# EAGLE board data-boardv5 (EAGLE 5.12)
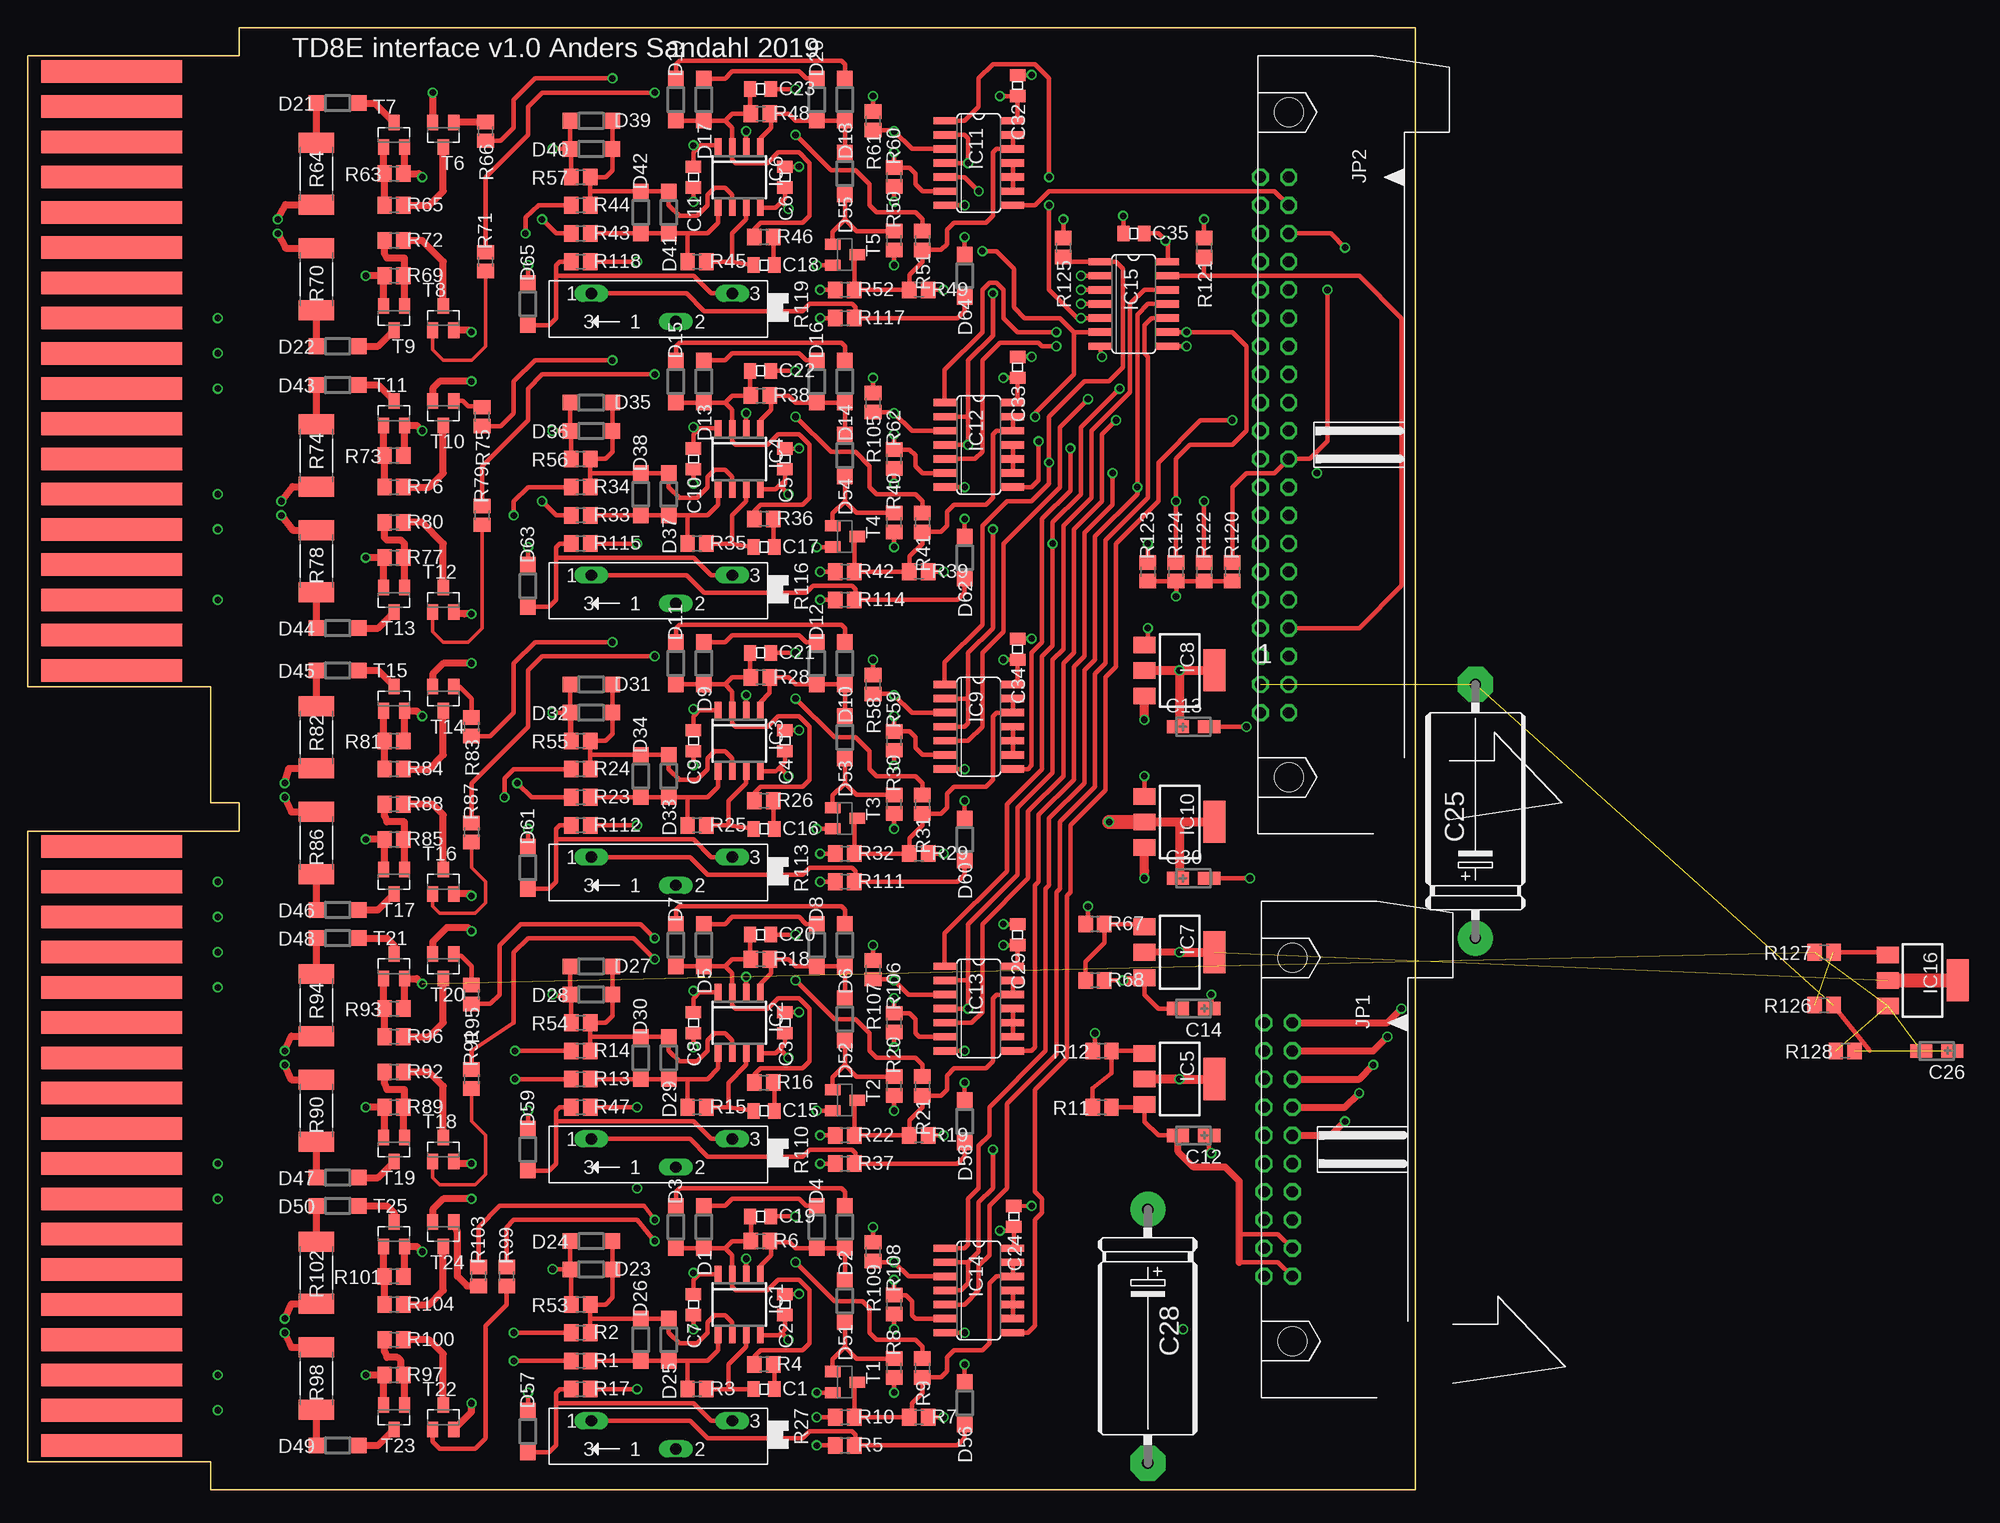
[diagram p13: board, top side]
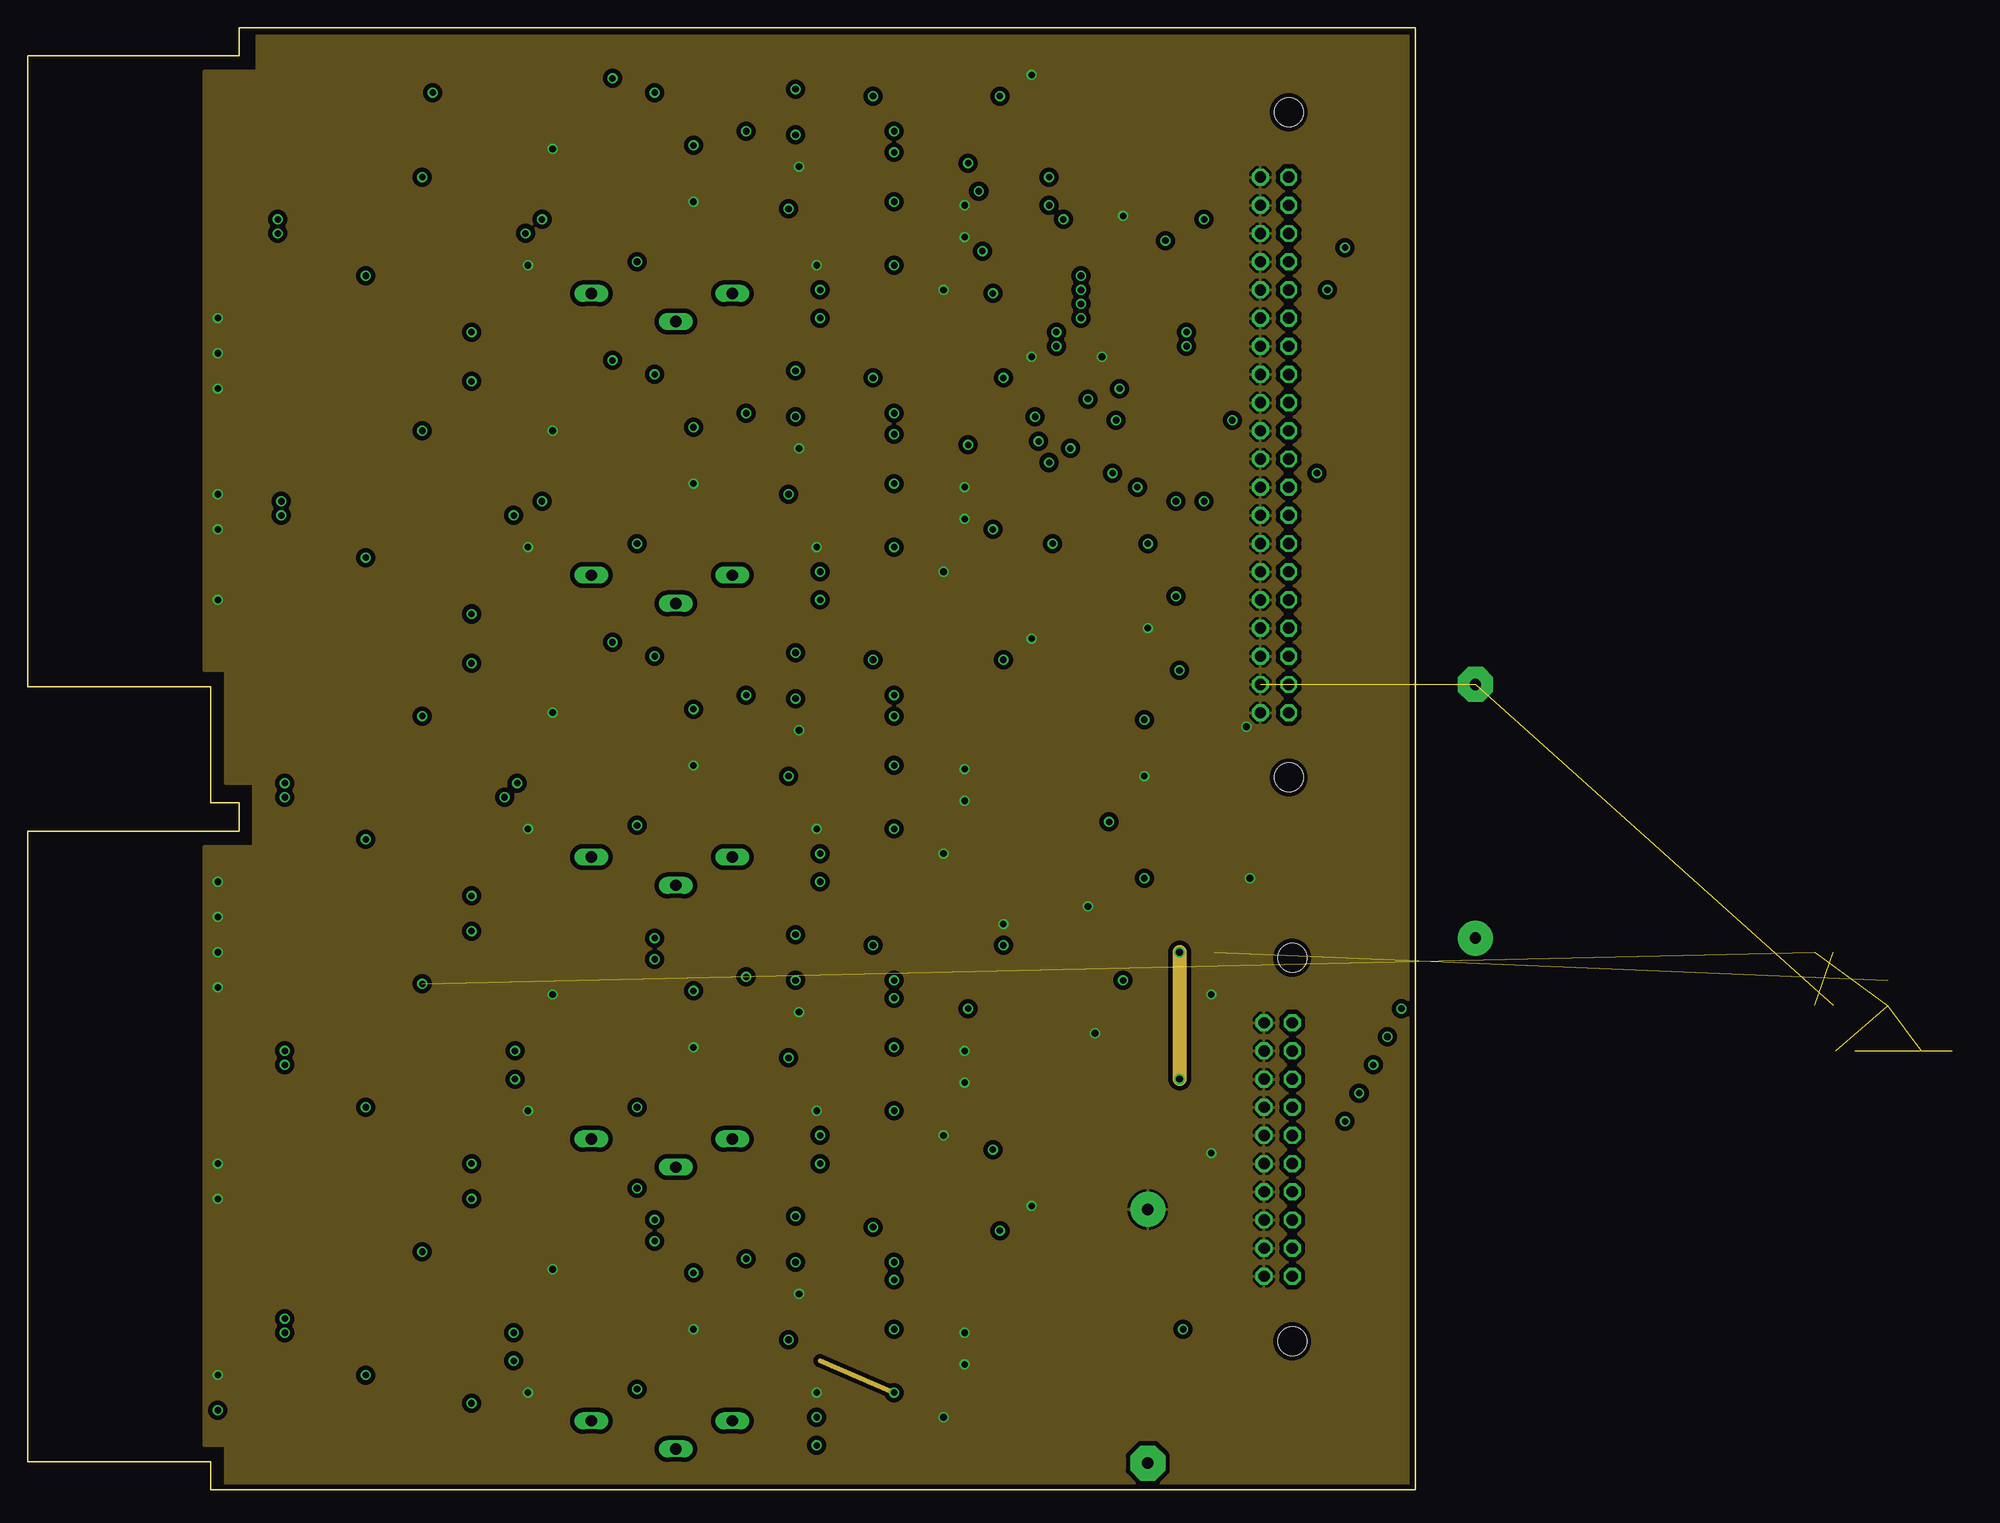
[diagram p14: board, inner layer Route2]
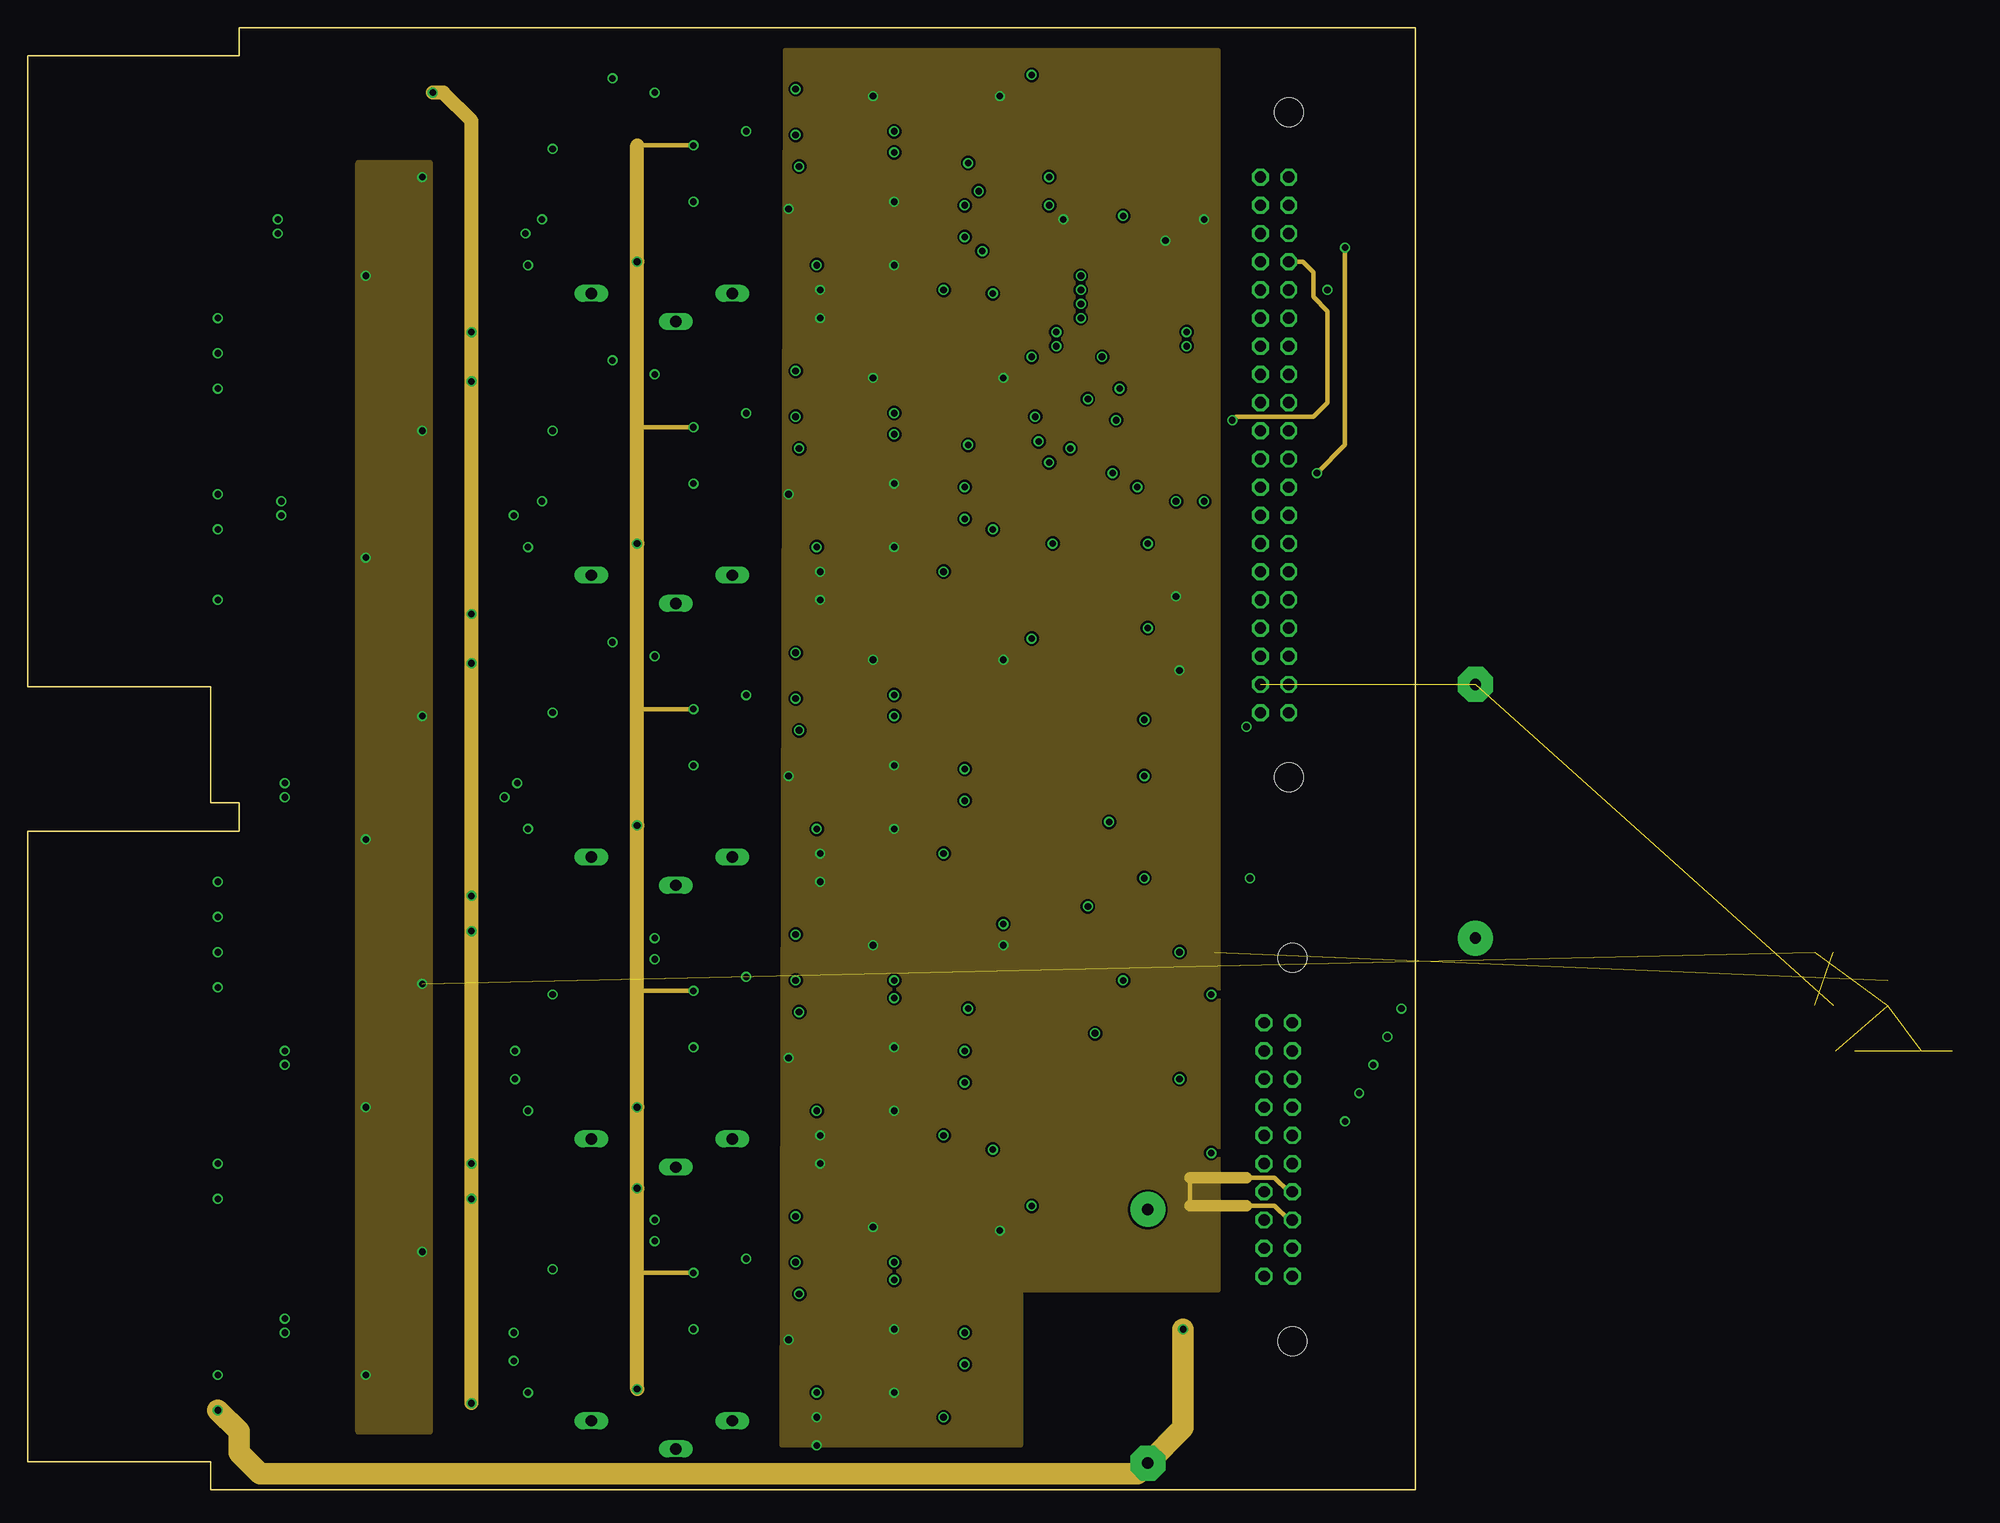
[diagram p15: board, inner layer Route15]
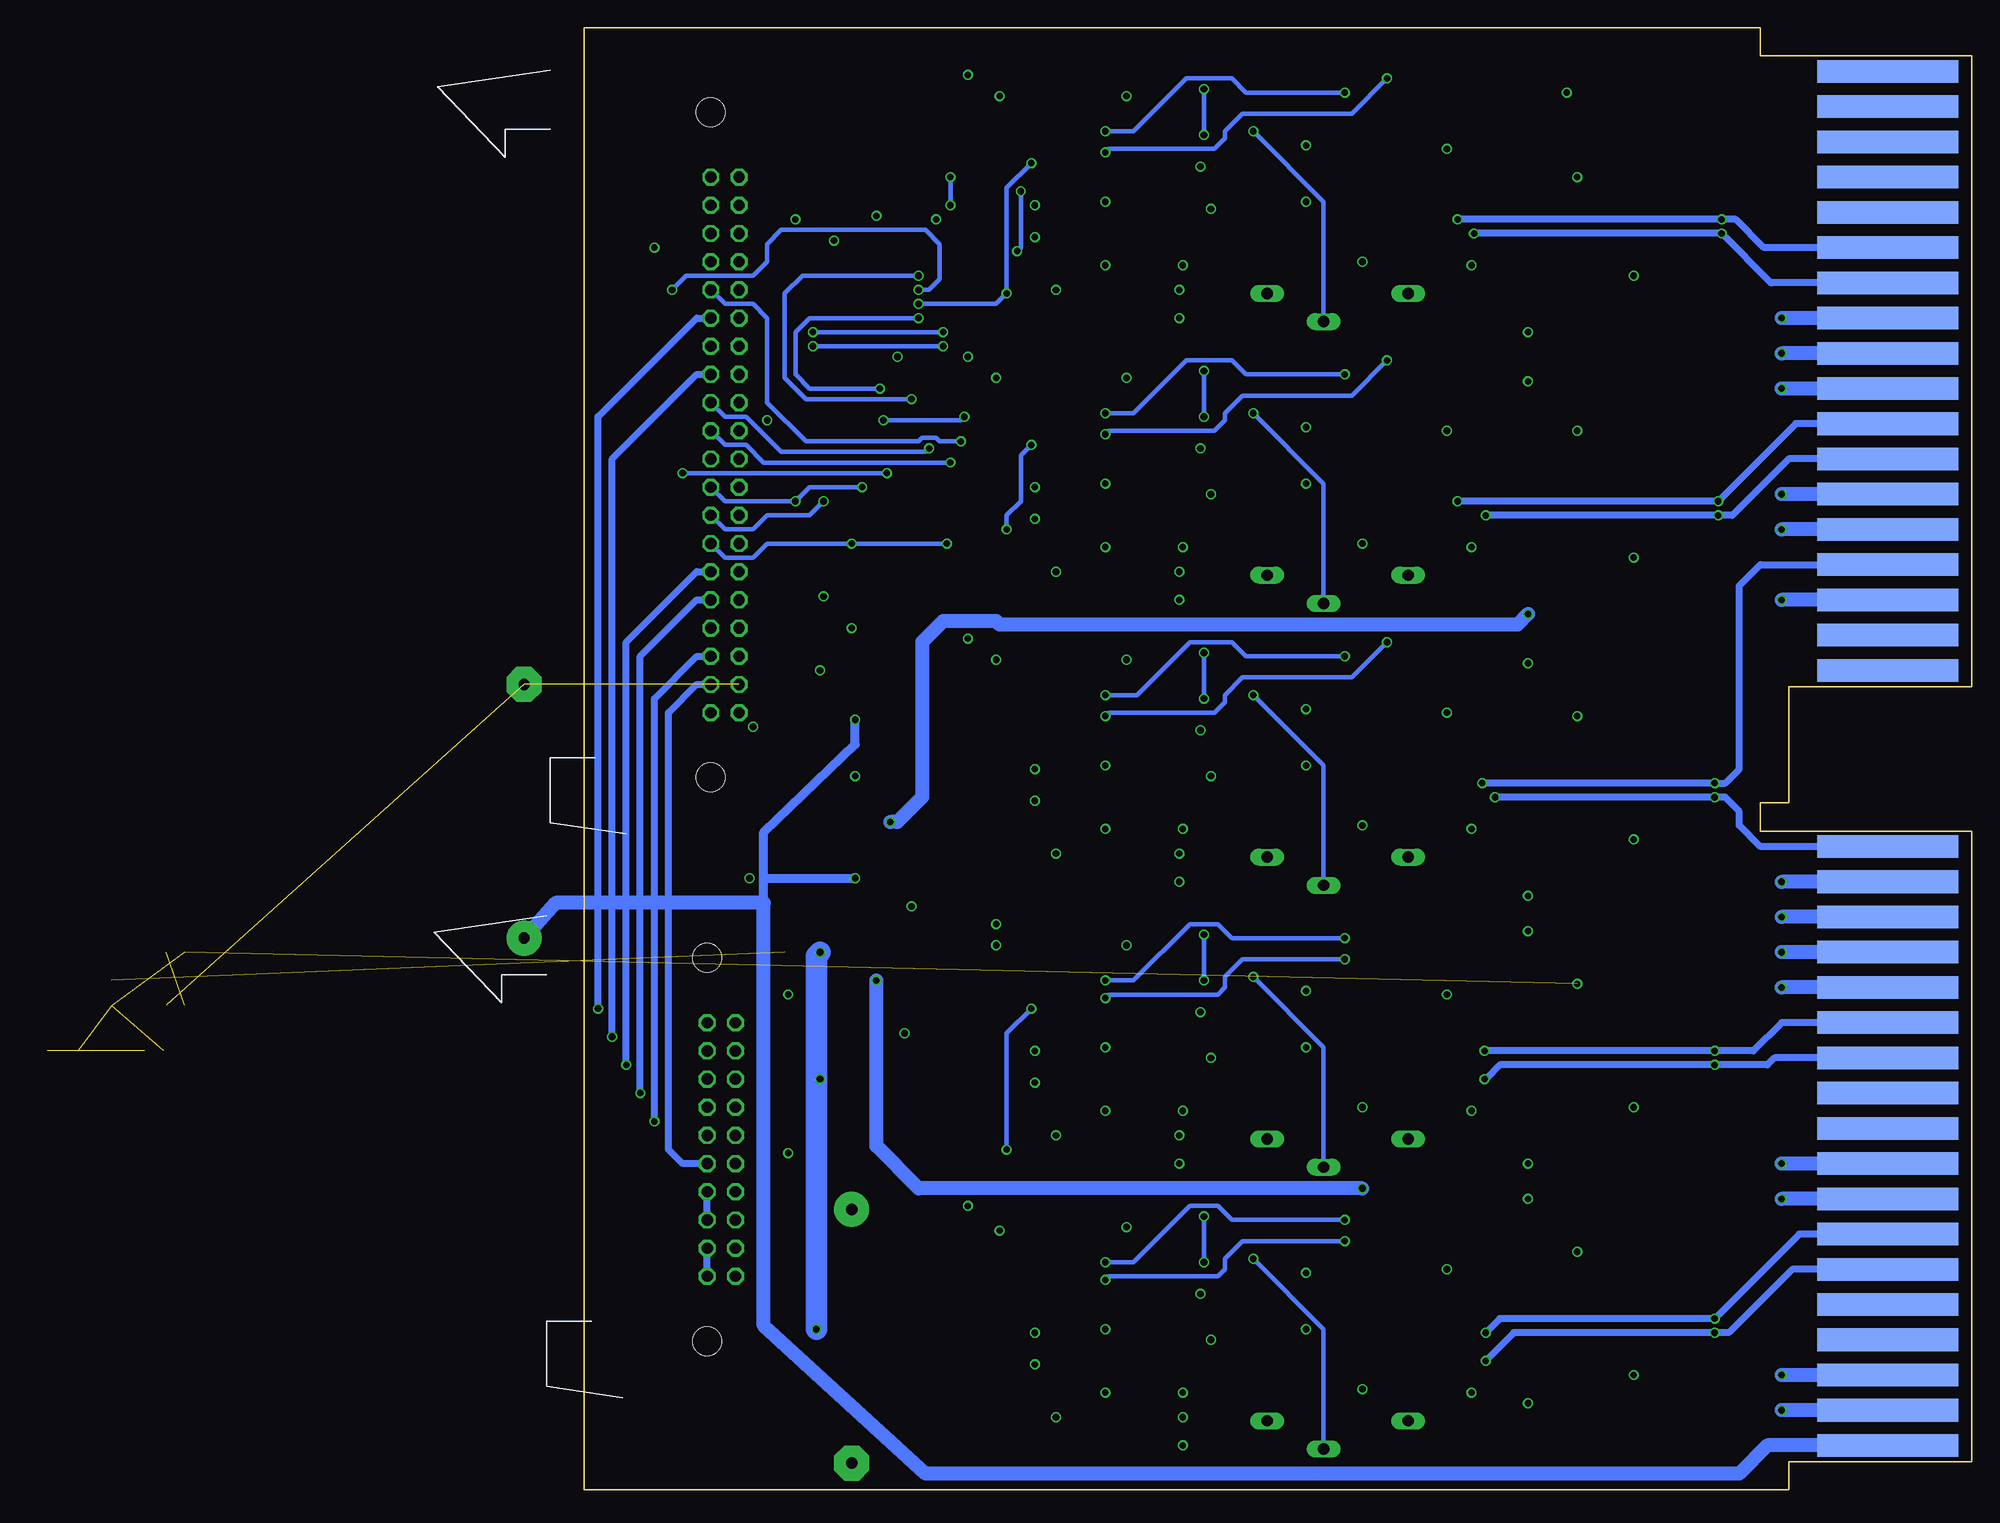
[diagram p16: board, bottom side, seen from below]

Size 125.09 x 131.76 mm. Coordinates in mm from the lower left corner, seen from the top.
Copper layers (1*2*15*16): Top 0.035mm / dielectric 0.2mm / Route2 0.0175mm / dielectric 0.3mm / Route15 0.0175mm / dielectric 0.2mm / Bottom 0.035mm
Design rules "SeeedStudio_4layer_DRU_no_angle_20140221": minimum track width 8mil, minimum drill 12mil, track to track 8mil, track to pad 8mil, pad to pad 8mil, via to via 8mil, smd to smd 0mil, copper to edge 10mil, drill to drill 8mil, minimum pad ring 6mil, minimum via ring 4mil, stop-mask expansion 4mil, vias tented up to drill 100mil, thermal gap 10mil

## Footprints (pad centres in the part's own frame; a part is rotated, then mirrored left to right if it is on the bottom)
0805 = smd 1.092 x 1.397: 1 -0.94,0; 2 0.94,0
CT3216 = smd 2 x 1.2: + -1.4,0; - 1.4,0
E22-9 = drill 1.016 pad 3.15 round: + -11.43,0 | drill 1.016 pad 3.15 octagon: - 11.43,0
SOD123 = smd 1.4 x 1.4: A 1.9,0; C -1.9,0
SOIC8 = smd 0.6 x 1.5: 1 -1.905,-2.75; 2 -0.635,-2.75; 3 0.635,-2.75; 4 1.905,-2.75; 5 1.905,2.75; 6 0.635,2.75; 7 -0.635,2.75; 8 -1.905,2.75
SOT223@1 = smd 1.5 x 2: 1 -2.3,-3.15; 2 0,-3.15; 3 2.3,-3.15 | smd 3.8 x 2: 4 0,3.15
SOT223@2 = smd 1.5 x 2: 1 -2.3,-3.15; 2 0,-3.15; 3 2.3,-3.15 | smd 3.8 x 2: 4 0,3.15
SOT223@3 = smd 1.5 x 2: 1 -2.3,-3.15; 2 0,-3.15; 3 2.3,-3.15 | smd 3.8 x 2: 4 0,3.15
SO14 = smd 0.66 x 2.032: 1 -3.81,-3.073; 2 -2.54,-3.073; 3 -1.27,-3.073; 4 0,-3.073; 5 1.27,-3.073; 6 2.54,-3.073; 7 3.81,-3.073; 8 3.81,3.073; 9 2.54,3.073; 10 1.27,3.073; 11 0,3.073; 12 -1.27,3.073; 13 -2.54,3.073; 14 -3.81,3.073
SOT223 = smd 1.5 x 2: 1 -2.3,-3.15; 2 0,-3.15; 3 2.3,-3.15 | smd 3.8 x 2: 4 0,3.15
FLIPCHIP-21 = smd 12.7 x 2.032: AA1 6.921,0; AB1 6.921,3.175; AC1 6.921,6.35; AD1 6.921,9.525; AE1 6.921,12.7; AF1 6.921,15.875; AH1 6.921,19.05; AJ1 6.921,22.225; AK1 6.921,25.4; AL1 6.921,28.575; AM1 6.921,31.75; AN1 6.921,34.925; AP1 6.921,38.1; AR1 6.921,41.275; AS1 6.921,44.45; AT1 6.921,47.625; AU1 6.921,50.8; AV1 6.921,53.975; BA1 6.921,69.85; BB1 6.921,73.025; BC1 6.921,76.2; BD1 6.921,79.375; BE1 6.921,82.55; BF1 6.921,85.725; BH1 6.921,88.9; BJ1 6.921,92.075; BK1 6.921,95.25; BL1 6.921,98.425; BM1 6.921,101.6; BN1 6.921,104.775; BP1 6.921,107.95; BR1 6.921,111.125; BS1 6.921,114.3; BT1 6.921,117.475; BU1 6.921,120.65; BV1 6.921,123.825 | smd 12.7 x 2.032 bottom: AA2 6.921,0; AB2 6.921,3.175; AC2 6.921,6.35; AD2 6.921,9.525; AE2 6.921,12.7; AF2 6.921,15.875; AH2 6.921,19.05; AJ2 6.921,22.225; AK2 6.921,25.4; AL2 6.921,28.575; AM2 6.921,31.75; AN2 6.921,34.925; AP2 6.921,38.1; AR2 6.921,41.275; AS2 6.921,44.45; AT2 6.921,47.625; AU2 6.921,50.8; AV2 6.921,53.975; BA2 6.921,69.85; BB2 6.921,73.025; BC2 6.921,76.2; BD2 6.921,79.375; BE2 6.921,82.55; BF2 6.921,85.725; BH2 6.921,88.9; BJ2 6.921,92.075; BK2 6.921,95.25; BL2 6.921,98.425; BM2 6.921,101.6; BN2 6.921,104.775; BP2 6.921,107.95; BR2 6.921,111.125; BS2 6.921,114.3; BT2 6.921,117.475; BU2 6.921,120.65; BV2 6.921,123.825
2Z10/90-FRAMED = drill 1.016 octagon: 1 -11.43,-6.35; 2 -11.43,-3.81; 3 -8.89,-6.35; 4 -8.89,-3.81; 5 -6.35,-6.35; 6 -6.35,-3.81; 7 -3.81,-6.35; 8 -3.81,-3.81; 9 -1.27,-6.35; 10 -1.27,-3.81; 11 1.27,-6.35; 12 1.27,-3.81; 13 3.81,-6.35; 14 3.81,-3.81; 15 6.35,-6.35; 16 6.35,-3.81; 17 8.89,-6.35; 18 8.89,-3.81; 19 11.43,-6.35; 20 11.43,-3.81 | hole 2.6: 17.272,-3.81; -17.272,-3.81
2X20/90-FRAMED = drill 1.016 octagon: 1 -24.13,-6.35; 2 -24.13,-3.81; 3 -21.59,-6.35; 4 -21.59,-3.81; 5 -19.05,-6.35; 6 -19.05,-3.81; 7 -16.51,-6.35; 8 -16.51,-3.81; 9 -13.97,-6.35; 10 -13.97,-3.81; 11 -11.43,-6.35; 12 -11.43,-3.81; 13 -8.89,-6.35; 14 -8.89,-3.81; 15 -6.35,-6.35; 16 -6.35,-3.81; 17 -3.81,-6.35; 18 -3.81,-3.81; 19 -1.27,-6.35; 20 -1.27,-3.81; 21 1.27,-6.35; 22 1.27,-3.81; 23 3.81,-6.35; 24 3.81,-3.81; 25 6.35,-6.35; 26 6.35,-3.81; 27 8.89,-6.35; 28 8.89,-3.81; 29 11.43,-6.35; 30 11.43,-3.81; 31 13.97,-6.35; 32 13.97,-3.81; 33 16.51,-6.35; 34 16.51,-3.81; 35 19.05,-6.35; 36 19.05,-3.81; 37 21.59,-6.35; 38 21.59,-3.81; 39 24.13,-6.35; 40 24.13,-3.81 | hole 2.6: 29.972,-3.81; -29.972,-3.81
R0805 = smd 1.3 x 1.5: 1 -0.85,0; 2 0.85,0
SP19L = drill 1.016 long: A 5.715,-1.27; E -6.985,-1.27; S -1.905,1.27
R2512 = smd 1.8 x 3.2: 1 -2.8,0; 2 2.8,0
SOT23 = smd 1 x 1.4: 1 -0.95,-1.1; 2 0.95,-1.1; 3 0,1.1

## Placement (x,y rotation side)
C1  10n  [0805]  66.36,9.08 0 top
C2  100n  [0805]  68.26,16.7 270 top
C3  100n  [0805]  68.26,42.1 270 top
C4  100n  [0805]  68.26,67.5 270 top
C5  100n  [0805]  68.26,92.9 270 top
C6  100n  [0805]  68.26,118.3 270 top
C7  100n  [0805]  60.01,16.7 270 top
C8  100n  [0805]  60.01,42.1 270 top
C9  100n  [0805]  60.01,67.5 270 top
C10  100n  [0805]  60.01,92.9 270 top
C11  100n  [0805]  60.01,118.3 270 top
C12  10u/10V  [CT3216]  105.09,31.94 180 top
C13  10u/10V  [CT3216]  105.09,68.77 0 top
C14  10u/10V  [CT3216]  105.09,43.37 180 top
C15  10n  [0805]  66.36,34.16 0 top
C16  10n  [0805]  66.36,59.56 0 top
C17  10n  [0805]  66.36,84.96 0 top
C18  10n  [0805]  66.36,110.36 0 top
C19  10p  [0805]  66.04,24.64 0 top
C20  10p  [0805]  66.04,50.04 0 top
C21  10p  [0805]  66.04,75.44 0 top
C22  10p  [0805]  66.04,100.84 0 top
C23  10p  [0805]  66.04,126.24 0 top
C24  100n  [0805]  88.9,24.64 270 top
C25  330u  [E22-9]  130.49,61.15 90 top  (outside the outline)
C26  10u/10V  [CT3216]  172.09,39.56 180 top  (outside the outline)
C28  330u  [E22-9]  100.96,13.84 270 top
C29  100n  [0805]  89.22,50.04 270 top
C30  10u/10V  [CT3216]  105.09,55.12 0 top
C32  100n  [0805]  89.22,126.56 270 top
C33  100n  [0805]  89.22,101.16 270 top
C34  100n  [0805]  89.22,75.76 270 top
C35  100n  [0805]  99.69,113.22 0 top
D1  1N4148  [SOD123]  60.96,23.69 270 top
D2  1N4148  [SOD123]  73.66,23.69 270 top
D3  1N4148  [SOD123]  58.42,23.69 90 top
D4  1N4148  [SOD123]  71.12,23.69 90 top
D5  1N4148  [SOD123]  60.96,49.09 270 top
D6  1N4148  [SOD123]  73.66,49.09 270 top
D7  1N4148  [SOD123]  58.42,49.09 90 top
D8  1N4148  [SOD123]  71.12,49.09 90 top
D9  1N4148  [SOD123]  60.96,74.49 270 top
D10  1N4148  [SOD123]  73.66,74.49 270 top
D11  1N4148  [SOD123]  58.42,74.49 90 top
D12  1N4148  [SOD123]  71.12,74.49 90 top
D13  1N4148  [SOD123]  60.96,99.89 270 top
D14  1N4148  [SOD123]  73.66,99.89 270 top
D15  1N4148  [SOD123]  58.42,99.89 90 top
D16  1N4148  [SOD123]  71.12,99.89 90 top
D17  1N4148  [SOD123]  60.96,125.29 270 top
D18  1N4148  [SOD123]  73.66,125.29 270 top
D19  1N4148  [SOD123]  58.42,125.29 90 top
D20  1N4148  [SOD123]  71.12,125.29 90 top
D21  MBR0540T1  [SOD123]  27.94,124.97 180 top
D22  MBR0540T1  [SOD123]  27.94,103.06 180 top
D23  1N4148  [SOD123]  50.8,19.88 0 top
D24  1N4148  [SOD123]  50.8,22.42 180 top
D25  1N4148  [SOD123]  57.79,13.53 270 top
D26  1N4148  [SOD123]  55.25,13.53 90 top
D27  1N4148  [SOD123]  50.8,47.18 0 top
D28  1N4148  [SOD123]  50.8,44.64 180 top
D29  1N4148  [SOD123]  57.79,38.93 270 top
D30  1N4148  [SOD123]  55.25,38.93 90 top
D31  1N4148  [SOD123]  50.8,72.58 0 top
D32  1N4148  [SOD123]  50.8,70.04 180 top
D33  1N4148  [SOD123]  57.79,64.33 270 top
D34  1N4148  [SOD123]  55.25,64.33 90 top
D35  1N4148  [SOD123]  50.8,97.98 0 top
D36  1N4148  [SOD123]  50.8,95.44 180 top
D37  1N4148  [SOD123]  57.79,89.73 270 top
D38  1N4148  [SOD123]  55.25,89.73 90 top
D39  1N4148  [SOD123]  50.8,123.38 0 top
D40  1N4148  [SOD123]  50.8,120.84 180 top
D41  1N4148  [SOD123]  57.79,115.13 270 top
D42  1N4148  [SOD123]  55.25,115.13 90 top
D43  MBR0540T1  [SOD123]  27.94,99.57 180 top
D44  MBR0540T1  [SOD123]  27.94,77.66 180 top
D45  MBR0540T1  [SOD123]  27.94,73.85 180 top
D46  MBR0540T1  [SOD123]  27.94,52.26 180 top
D47  MBR0540T1  [SOD123]  27.94,28.13 180 top
D48  MBR0540T1  [SOD123]  27.94,49.72 180 top
D49  MBR0540T1  [SOD123]  27.94,4 180 top
D50  MBR0540T1  [SOD123]  27.94,25.59 180 top
D51  1N4148  [SOD123]  73.66,17.02 270 top
D52  1N4148  [SOD123]  73.66,42.42 270 top
D53  1N4148  [SOD123]  73.66,67.82 270 top
D54  1N4148  [SOD123]  73.66,93.22 270 top
D55  1N4148  [SOD123]  73.66,118.62 270 top
D56  1N4148  [SOD123]  84.45,7.81 270 top
D57  1N4148  [SOD123]  45.09,5.27 90 top
D58  1N4148  [SOD123]  84.45,33.21 270 top
D59  1N4148  [SOD123]  45.09,30.67 90 top
D60  1N4148  [SOD123]  84.45,58.61 270 top
D61  1N4148  [SOD123]  45.09,56.07 90 top
D62  1N4148  [SOD123]  84.45,84.01 270 top
D63  1N4148  [SOD123]  45.09,81.47 90 top
D64  1N4148  [SOD123]  84.45,109.41 270 top
D65  1N4148  [SOD123]  45.09,106.87 90 top
IC1  OPA2134D  [SOIC8]  64.13,16.7 180 top
IC2  OPA2134D  [SOIC8]  64.13,42.1 180 top
IC3  OPA2134D  [SOIC8]  64.13,67.5 180 top
IC4  OPA2134D  [SOIC8]  64.13,92.9 180 top
IC5  LM337  [SOT223@1]  103.82,37.02 270 top
IC6  OPA2134D  [SOIC8]  64.13,118.3 180 top
IC7  LM337  [SOT223@2]  103.82,48.45 270 top
IC8  LM1117-5  [SOT223@3]  103.82,73.85 270 top
IC9  7400D  [SO14]  85.72,68.77 270 top
IC10  LM1117-3.3  [SOT223@3]  103.82,60.2 270 top
IC11  7400D  [SO14]  85.72,119.57 270 top
IC12  7400D  [SO14]  85.72,94.17 270 top
IC13  7400D  [SO14]  85.72,43.37 270 top
IC14  7400D  [SO14]  85.72,17.97 270 top
IC15  7404D  [SO14]  99.69,106.87 270 top
IC16  LM337  [SOT223]  170.81,45.91 270 top  (outside the outline)
J1  FLIPCHIP_2  [FLIPCHIP-21]  0.64,4 0 top
JP1  [2Z10/90-FRAMED]  117.79,30.67 270 top
JP2  [2X20/90-FRAMED]  117.47,94.17 270 top
R1  220  [R0805]  49.85,11.62 0 top
R2  220  [R0805]  49.85,14.16 0 top
R3  22k  [R0805]  60.33,9.08 0 top
R4  4k7  [R0805]  66.36,11.3 0 top
R5  2k2  [R0805]  73.66,4 0 top
R6  470k  [R0805]  66.04,22.42 0 top
R7  3k  [R0805]  80.33,6.54 0 top
R8  4k7  [R0805]  78.1,10.99 90 top
R9  470k  [R0805]  80.64,10.99 270 top
R10  1k  [R0805]  73.66,6.54 0 top
R11  240  [R0805]  96.84,34.48 180 top
R12  330  [R0805]  96.84,39.56 180 top
R13  220  [R0805]  49.85,37.02 0 top
R14  220  [R0805]  49.85,39.56 0 top
R15  22k  [R0805]  60.33,34.48 0 top
R16  4k7  [R0805]  66.36,36.7 0 top
R17  2k2  [R0805]  49.85,9.08 0 top
R18  470k  [R0805]  66.04,47.82 0 top
R19  3k  [R0805]  80.33,31.94 0 top
R20  4k7  [R0805]  78.1,36.39 90 top
R21  470k  [R0805]  80.64,36.39 270 top
R22  1k  [R0805]  73.66,31.94 0 top
R23  220  [R0805]  49.85,62.42 0 top
R24  220  [R0805]  49.85,64.96 0 top
R25  22k  [R0805]  60.33,59.88 0 top
R26  4k7  [R0805]  66.36,62.1 0 top
R27  10k  [SP19L]  56.52,4.95 180 top
R28  470k  [R0805]  66.04,73.22 0 top
R29  3k  [R0805]  80.33,57.34 0 top
R30  4k7  [R0805]  78.1,61.79 90 top
R31  470k  [R0805]  80.64,61.79 270 top
R32  1k  [R0805]  73.66,57.34 0 top
R33  220  [R0805]  49.85,87.82 0 top
R34  220  [R0805]  49.85,90.36 0 top
R35  22k  [R0805]  60.33,85.28 0 top
R36  4k7  [R0805]  66.36,87.5 0 top
R37  2k2  [R0805]  73.66,29.4 0 top
R38  470k  [R0805]  66.04,98.62 0 top
R39  3k  [R0805]  80.33,82.74 0 top
R40  4k7  [R0805]  78.1,87.19 90 top
R41  470k  [R0805]  80.64,87.19 270 top
R42  1k  [R0805]  73.66,82.74 0 top
R43  220  [R0805]  49.85,113.22 0 top
R44  220  [R0805]  49.85,115.76 0 top
R45  22k  [R0805]  60.33,110.68 0 top
R46  4k7  [R0805]  66.36,112.9 0 top
R47  2k2  [R0805]  49.85,34.48 0 top
R48  470k  [R0805]  66.04,124.02 0 top
R49  3k  [R0805]  80.33,108.14 0 top
R50  4k7  [R0805]  78.1,112.59 90 top
R51  470k  [R0805]  80.64,112.59 270 top
R52  1k  [R0805]  73.66,108.14 0 top
R53  22k  [R0805]  49.85,16.7 180 top
R54  22k  [R0805]  49.85,42.1 180 top
R55  22k  [R0805]  49.85,67.5 180 top
R56  22k  [R0805]  49.85,92.9 180 top
R57  22k  [R0805]  49.85,118.3 180 top
R58  1k  [R0805]  76.2,72.58 270 top
R59  1k  [R0805]  78.1,67.5 90 top
R60  1k  [R0805]  78.1,118.3 90 top
R61  1k  [R0805]  76.2,123.38 270 top
R62  1k  [R0805]  78.1,92.9 90 top
R63  150  [R0805]  33.02,118.62 180 top
R64  75 2W  [R2512]  26.04,118.62 270 top
R65  680  [R0805]  33.02,115.76 0 top
R66  6k8  [R0805]  41.27,122.43 270 top
R67  720  [R0805]  96.2,50.99 0 top
R68  240  [R0805]  96.2,45.91 0 top
R69  150  [R0805]  33.02,109.41 0 top
R70  75 2W  [R2512]  26.04,109.09 90 top
R71  6k8  [R0805]  41.27,110.68 90 top
R72  680  [R0805]  33.02,112.59 0 top
R73  150  [R0805]  33.02,93.22 180 top
R74  75 2W  [R2512]  26.04,93.22 270 top
R75  6k8  [R0805]  40.96,96.71 270 top
R76  680  [R0805]  33.02,90.36 0 top
R77  150  [R0805]  33.02,84.01 0 top
R78  75 2W  [R2512]  26.04,83.69 90 top
R79  6k8  [R0805]  40.96,87.82 90 top
R80  680  [R0805]  33.02,87.19 0 top
R81  150  [R0805]  33.02,67.5 180 top
R82  75 2W  [R2512]  26.04,67.82 270 top
R83  6k8  [R0805]  40.01,68.77 270 top
R84  680  [R0805]  33.02,64.96 0 top
R85  150  [R0805]  33.02,58.61 0 top
R86  75 2W  [R2512]  26.04,58.29 90 top
R87  6k8  [R0805]  40.01,59.25 90 top
R88  680  [R0805]  33.02,61.79 0 top
R89  150  [R0805]  33.02,34.48 0 top
R90  75 2W  [R2512]  26.04,34.16 90 top
R91  6k8  [R0805]  40.01,37.02 90 top
R92  680  [R0805]  33.02,37.66 0 top
R93  150  [R0805]  33.02,43.37 180 top
R94  75 2W  [R2512]  26.04,43.69 270 top
R95  6k8  [R0805]  40.01,44.64 270 top
R96  680  [R0805]  33.02,40.83 0 top
R97  150  [R0805]  33.02,10.35 0 top
R98  75 2W  [R2512]  26.04,10.03 90 top
R99  6k8  [R0805]  43.18,19.24 90 top
R100  680  [R0805]  33.02,13.53 0 top
R101  150  [R0805]  33.02,19.24 180 top
R102  75 2W  [R2512]  26.04,19.56 270 top
R103  6k8  [R0805]  40.64,19.24 90 top
R104  680  [R0805]  33.02,16.7 0 top
R105  1k  [R0805]  76.2,97.98 270 top
R106  1k  [R0805]  78.1,42.1 90 top
R107  1k  [R0805]  76.2,46.86 270 top
R108  1k  [R0805]  78.1,16.7 90 top
R109  1k  [R0805]  76.2,21.46 270 top
R110  10k  [SP19L]  56.52,30.35 180 top
R111  2k2  [R0805]  73.66,54.8 0 top
R112  2k2  [R0805]  49.85,59.88 0 top
R113  10k  [SP19L]  56.52,55.75 180 top
R114  2k2  [R0805]  73.66,80.2 0 top
R115  2k2  [R0805]  49.85,85.28 0 top
R116  10k  [SP19L]  56.52,81.15 180 top
R117  2k2  [R0805]  73.66,105.6 0 top
R118  2k2  [R0805]  49.85,110.68 0 top
R119  10k  [SP19L]  56.52,106.55 180 top
R120  470  [R0805]  108.58,82.74 90 top
R121  470  [R0805]  106.05,111.95 270 top
R122  470  [R0805]  106.05,82.74 90 top
R123  470  [R0805]  100.96,82.74 90 top
R124  470  [R0805]  103.5,82.74 90 top
R125  470  [R0805]  93.34,111.95 270 top
R126  2k05  [R0805]  161.93,43.69 180 top  (outside the outline)
R127  240  [R0805]  161.93,48.45 180 top  (outside the outline)
R128  1k8  [R0805]  163.83,39.56 180 top  (outside the outline)
T1  BC847  [SOT23]  73.66,9.72 270 top
T2  BC847  [SOT23]  73.66,35.12 270 top
T3  BC847  [SOT23]  73.66,60.52 270 top
T4  BC847  [SOT23]  73.66,85.92 270 top
T5  BC847  [SOT23]  73.66,111.32 270 top
T6  BC857B  [SOT23]  37.47,122.11 180 top
T7  IRLML0100TR  [SOT23]  33.02,122.11 0 top
T8  BC857B  [SOT23]  37.47,105.6 0 top
T9  IRLML0100TR  [SOT23]  33.02,105.6 180 top
T10  BC857B  [SOT23]  37.47,97.03 180 top
T11  IRLML0100TR  [SOT23]  33.02,97.03 0 top
T12  BC857B  [SOT23]  37.47,80.2 0 top
T13  IRLML0100TR  [SOT23]  33.02,80.2 180 top
T14  BC857B  [SOT23]  37.47,71.31 180 top
T15  IRLML0100TR  [SOT23]  33.02,71.31 0 top
T16  BC857B  [SOT23]  37.47,54.8 0 top
T17  IRLML0100TR  [SOT23]  33.02,54.8 180 top
T18  BC857B  [SOT23]  37.47,30.67 0 top
T19  IRLML0100TR  [SOT23]  33.02,30.67 180 top
T20  BC857B  [SOT23]  37.47,47.18 180 top
T21  IRLML0100TR  [SOT23]  33.02,47.18 0 top
T22  BC857B  [SOT23]  37.47,6.54 0 top
T23  IRLML0100TR  [SOT23]  33.02,6.54 180 top
T24  BC857B  [SOT23]  37.47,23.05 180 top
T25  IRLML0100TR  [SOT23]  33.02,23.05 0 top

## Tracks (layer width: path | path; a pad name or v marks a point on that pad's centre or on a via)
+3.3V  (via drill 0.6)
  Top 0.61: T22.2 40.01,7.03 v40.01,7.81 | T24.2 36.52,25.28 37.47,26.23 v40.01,26.23 | T18.2 38.41,29.4 v40.01,29.4 | T20.2 36.52,49.41 37.78,50.67 39.69,50.67 v40.01,50.36 | T14.2 36.52,73.54 37.47,74.49 v40.01,74.49 | T16.2 40.01,53.7 v40.01,53.53 | T12.2 38.57,79.1 38.73,78.95 39.37,78.93 v40.01,78.93 | T10.2 36.52,99.25 37.15,99.89 v40.01,99.89 | T8.2 39.84,104.5 v40.01,104.33 | T6.2 v36.52,125.92 v36.51,125.92
  Top 0.813: IC10.2 103.82,60.2 | 103.82,60.2 IC10.4 | C30.+ 103.82,55.12 103.82,60.2
  Top 1.27: v97.47,60.2 IC10.2
  Route15 1.27: v40.01,7.81 v40.01,26.23 v40.01,29.4 v40.01,50.36 v40.01,53.53 v40.01,74.49 v40.01,78.93 v40.01,99.89 v40.01,104.33 40.01,123.38 37.47,125.92 v36.51,125.92
  Bottom 1.27: v97.47,60.2 96.84,60.2 94.61,62.42 94.61,76.39 92.71,78.3 87.95,78.3 87.63,77.98 40.96,77.98 v40.01,78.93
+10V  (via drill 0.6)
  Top 0.813: IC10.3 100.67,55.78 v100.65,55.12 | IC8.3 100.67,69.41 v100.65,69.41
  Bottom 0.813: 108.9,55.12 v100.65,55.12 | 108.9,52.9 108.9,55.12 | 108.9,55.12 108.9,59.25 100.65,67.18 v100.65,69.41
  Bottom 1.27: J1.AA2 18.41,4 20.95,1.46 94.3,1.46 108.9,14.8 108.9,52.9 127.64,52.9 C25.+
-3V
  Top 0.406: R11.1 100.43,34.48 IC5.3 100.67,33.19 101.92,31.94 C12.- | JP1.18 112.71,23.05 109.22,23.05 109.22,20.51 112.71,20.51 JP1.20
  Top 0.61: C12.- 103.69,30.48 105.09,29.08 107.95,29.08 109.22,27.81 109.22,20.51
  Top 0.813: C12.- 103.82,31.71
  Bottom 0.61: JP1.20 JP1.18
-12V  (via drill 0.6)  (4 unrouted)
  Top 0.305: 33.97,93.22 R73.1
  Top 0.61: T13.2 32.07,83.91 R77.1 v30.48,84.01 | 33.66,92.9 33.97,93.22 T11.2 35.07,95.93 v35.56,95.44 | T19.2 32.17,31.77 R89.1 v30.48,34.48 | R93.1 33.97,43.47 T21.2 35.07,46.08 v35.56,45.59 | R101.1 33.97,19.34 T25.2 35.07,21.95 v35.56,21.46 | T7.2 33.97,118.72 R63.1 35.24,118.62 v35.56,118.3 | R81.1 33.97,67.6 T15.2 35.07,70.21 v35.56,69.72 | T9.2 32.07,109.31 R69.1 v30.48,109.41 | T17.2 32.17,56 R85.1 v30.48,58.61 | T23.2 32.07,10.25 R97.1 v30.48,10.35
  pour Route15: 36.2,119.57 36.2,5.27 29.84,5.27 29.84,119.57
-15V  (via drill 0.6)  (1 unrouted)
  Top 0.61: v103.82,48.45 IC7.2
  Top 0.813: IC5.4 v103.82,37.02 IC5.2 | v103.82,48.45 IC7.4
  Top 1.27: IC16.2 IC16.4
  Route2 1.27: v103.82,48.45 v103.82,37.02
  Route15 1.93: v17.14,7.18 19.05,5.27 19.05,3.37 20.95,1.46 100.01,1.46 C28.- 104.14,5.59 v104.14,14.48
  Bottom 1.27: J1.AB2 v17.14,7.18
  Bottom 1.93: v104.14,14.48 104.14,48.13 v103.82,48.45
CON_ALL_HALT_L  (via drill 0.6)
  Top 0.61: JP1.10 117.47,31.94 v118.74,33.21
  Bottom 0.61: v118.74,33.21 118.74,71.31 114.93,75.12 JP2.36
D0(0)  (via drill 0.6)
  Top 0.406: v46.36,114.49 47.62,113.22 R43.1
  Top 0.61: R64.2 23.23,115.82 v22.54,114.49
  Bottom 0.61: J1.BP2 18.73,111.95 21.27,114.49 v22.54,114.49 v46.36,114.49
D0(1)  (via drill 0.6)
  Top 0.406: R44.1 46.04,115.76 44.87,114.71 v44.87,113.22
  Top 0.61: R70.2 23.23,111.89 v22.54,113.22
  Bottom 0.61: v44.87,113.22 v22.54,113.22 18.1,108.78 J1.BN2
D1(0)  (via drill 0.6)
  Top 0.406: v46.36,89.09 47.62,87.82 R33.1
  Top 0.61: R74.2 23.87,90.42 v22.86,89.09
  Bottom 0.61: v46.36,89.09 v22.86,89.09 15.88,96.08 J1.BJ2
D1(1)  (via drill 0.6)
  Top 0.406: R34.1 45.09,90.36 43.82,89.09 v43.82,87.82
  Top 0.61: R78.2 23.87,86.49 v22.86,87.82
  Bottom 0.61: J1.BH2 16.51,92.9 21.59,87.82 v22.86,87.82 v43.82,87.82
D2(0)  (via drill 0.6)
  Top 0.406: v44.13,63.69 45.4,62.42 R23.1
  Top 0.61: R82.2 23.55,65.02 v23.18,63.69
  Bottom 0.61: v44.13,63.69 v23.18,63.69 22.22,63.69 20.95,64.96 20.95,81.47 19.05,83.38 J1.BD2
D2(1)  (via drill 0.6)
  Top 0.406: v42.97,62.42 42.97,64.11 43.82,64.96 R24.1
  Top 0.61: R86.2 23.75,61.09 v23.18,62.42
  Bottom 0.61: J1.AV2 19.05,57.98 20.95,59.88 20.95,61.15 22.22,62.42 v23.18,62.42 v42.97,62.42
DATA1
  Top 0.406: T5.3 74.51,111.07 R52.2 R49.1 79.48,109.51 80.64,110.68 R51.2 82.33,111.74 82.87,112.27 82.87,113.54 83.5,114.17 86.36,114.17 86.99,114.81 86.99,120.52 87.31,120.84 IC11.12 IC11.13
DATA2
  Top 0.406: IC12.13 IC12.12 87.31,95.44 86.99,95.12 86.99,89.41 86.36,88.77 83.5,88.77 82.87,88.14 82.87,86.87 82.33,86.34 R41.2 80.64,85.28 79.48,84.11 R39.1 R42.2 74.51,85.67 T4.3
DATA3
  Top 0.406: T3.3 74.51,60.27 R32.2 R29.1 79.48,58.71 80.64,59.88 R31.2 82.33,60.94 82.87,61.47 82.87,62.74 83.5,63.37 86.36,63.37 86.99,64.01 86.99,69.72 87.31,70.04 IC9.12 IC9.13
F/R(0)_H
  Bottom 0.61: JP1.12 116.2,29.4 117.47,30.67 117.47,70.04 114.93,72.58 JP2.38
GND  (via drill 0.6)  (4 unrouted)
  Top 0.305: 49,95.44 D36.A | 49,120.84 D40.A | 49,44.54 D28.A
  Top 0.406: D23.C v47.31,19.88 | D23.C D24.A | R53.2 49,19.46 D23.C | T1.2 71.43,8.76 v71.12,8.76 | IC8.1 101.04,76.15 v100.96,77.66 | C30.- v110.17,55.12 | v100.65,64.33 100.65,62.52 IC10.1 | R54.2 49,44.54 47.41,44.54 v47.31,44.64 | D28.A D27.C | R19.2 v82.55,31.94 | D31.C D32.A 48.9,67.6 R55.2 49,69.94 D32.A v47.31,70.04 | R29.2 v82.55,57.34 | T3.2 72.39,59.57 v71.12,59.56 | D35.C D36.A v47.31,95.44 | R56.2 49,95.44 | R39.2 v82.55,82.74 | T4.2 72.71,84.97 v71.12,84.96 | C14.+ 106.68,43.37 v106.68,44.64 | D40.A D39.C | R57.2 49,120.84 v47.31,120.84 | R49.2 v82.55,108.14 | v71.12,110.36 T5.2 | R67.1 95.57,50.99 v95.57,52.58 | T2.2 72.39,34.17 v71.12,34.16 | C2.1 v69.53,17.65 | C7.2 v60.01,14.48 | D57.A v45.09,8.76 | R7.2 v82.55,6.54 | IC14.7 v84.45,14.16 | C24.1 v90.49,25.59 | D59.A v45.09,34.16 | C8.2 v60.01,39.88 | C3.1 69.52,43.04 v69.53,43.05 | C12.+ 106.49,30.54 v106.68,30.35 | IC13.7 v84.45,39.56 | D58.C v84.45,36.7 | C29.1 v87.95,50.99 | C9.2 v60.01,65.28 | D61.A v45.09,59.56 | D63.A v45.09,84.96 | v69.53,68.45 68.27,68.45 C4.1 | D60.C v84.45,62.1 | C34.1 v90.49,76.71 | IC9.7 v84.45,64.96 | C10.2 v60.01,90.68 | C5.1 69.52,93.84 v69.53,93.85 | D62.C v84.45,87.5 | IC12.7 v84.45,90.36 | C33.1 90.47,102.1 v90.49,102.11 | D65.A v45.09,110.36 | D64.C v84.45,112.9 | IC11.7 v84.45,115.76 | C6.1 69.52,119.24 v69.53,119.25 | C11.2 v60.01,116.08 | C32.1 90.47,127.5 v90.49,127.51 | D56.C v84.45,11.3 | v96.84,102.11 IC15.7 | C35.1 98.75,114.48 v98.74,114.81 | v96.2,41.15 96.2,39.78 R12.2 | C13.- v109.85,68.77 | R126.1 166.05,39.56
  Route2 0.406: v45.09,8.76 45.09,9.08
  Bottom 0.406: J1.BK2 6.99,99.25
  Bottom 1.27: J1.BM2 v17.14,105.6 | J1.BK2 v17.14,99.25 | J1.BF2 v17.14,89.73 | J1.BE2 v17.14,86.55 | J1.BL2 v17.14,102.43 | J1.AU2 v17.14,54.8 | J1.AT2 v17.14,51.63 | J1.AS2 v17.14,48.45 | J1.AR2 v17.14,45.28 | J1.AK2 v17.14,29.4 | J1.AJ2 v17.14,26.23 | J1.AC2 v17.14,10.35 | J1.BC2 v17.14,80.2
  pour Route2 (isolate 0.406): 124.46,131 20.64,131 20.64,127.83 15.88,127.83 15.88,73.85 17.78,73.85 17.78,63.69 20.32,63.69 20.32,57.98 15.88,57.98 15.88,4 17.78,4 17.78,0.51 124.46,0.51
MARK
  Top 0.406: T2.3 74.51,34.87 R22.2 R19.1 79.48,33.31 80.64,34.48 R21.2 82.33,35.54 82.87,36.07 82.87,37.34 83.5,37.97 86.36,37.97 86.99,38.61 86.99,44.32 87.31,44.64 IC13.12 IC13.13
MT(0)  (via drill 0.6)
  Top 0.406: v43.92,37.02 R13.1
  Top 0.61: v23.18,38.29 23.75,36.96 R90.2
  Bottom 0.61: J1.AN2 17.78,38.93 18.41,38.29 v23.18,38.29 42.55,38.29 43.82,37.02 v43.92,37.02
MT(1)  (via drill 0.6)
  Top 0.406: v43.92,39.56 R14.1
  Top 0.61: R94.2 23.75,40.89 v23.18,39.56
  Bottom 0.61: J1.AP2 17.14,42.1 19.68,39.56 v23.18,39.56 v43.92,39.56
N$1
  Top 0.406: 59.48,11.62 R3.1 | 59.48,11.62 59.15,11.63 D25.A D26.C 51.66,11.63 R1.2 | IC1.5 62.23,12.57 61.28,11.62 59.48,11.62
N$2
  Top 0.406: T10.1 39.22,98.13 39.69,97.66 40.86,97.66 R75.1
N$3
  Top 0.406: 63.18,9.08 63.18,11.3 64.77,12.89 IC1.7 | R3.2 63.18,9.08 | 63.18,9.08 C1.1
N$4
  Top 0.406: D1.C 62.86,25.59 63.5,26.23 69.53,26.23 70.17,25.59 D4.A
N$5
  Top 0.406: D3.C D1.A 62.87,21.78 | 62.87,21.78 63.5,22.42 R6.1 65.19,24.23 C19.1 | 62.87,21.78 63.5,21.15 IC1.3 63.5,18.29 63.82,17.97 66.67,17.97 67.63,18.92 69.53,18.92 70.48,17.97 70.48,13.21 69.85,12.57 66.04,12.57 65.51,12.04 R4.1
N$6
  Top 0.61: D43.A 26.04,95.71 R74.1
N$7
  Top 0.406: 66.99,22.31 66.99,21.15 66.04,20.19 IC1.1 | 66.99,22.31 R6.2 | 66.99,22.31 68.68,22.31 69.21,21.78 D4.C 71.75,21.78 | 71.75,21.78 D2.A D51.C | D4.C 71.75,21.79 71.75,21.78
N$8
  Top 0.406: T1.1 72.56,11.79 73.66,12.89 | 73.66,12.89 D51.A | R8.2 74.71,11.84 73.66,12.89
N$9  (via drill 0.6)
  Top 0.406: v69.21,24.64 C19.2 | v69.21,20.51 72.71,17.02 75.25,17.02 75.88,16.38 75.88,14.16 76.52,13.53 80.01,13.53 80.64,12.89 R9.1
  Bottom 0.406: v69.21,20.51 v69.21,24.64
N$10  (via drill 0.6)
  Top 0.406: v69.21,126.24 C23.2 | v69.21,122.11 72.39,118.94 74.61,118.94 75.88,117.67 75.88,115.76 76.52,115.13 80.01,115.13 80.64,114.49 R51.1
  Bottom 0.406: v69.21,122.11 v69.21,126.24
N$11
  Top 0.406: D3.A 58.42,26.86 58.74,27.18 73.34,27.18 73.66,26.86 D2.C
N$12
  Top 0.406: C1.2 67.3,11.21 R4.2
N$13
  Top 0.61: D43.C 31.58,99.57 T11.3
N$15
  Top 0.61: T10.3 37.47,91.63 36.2,90.36 R76.2
N$17
  Top 0.61: T11.1 32.07,93.32 R73.2 R76.1
N$18
  Top 0.305: T12.1 36.52,77.34 37.47,76.39 39.69,76.39 40.96,77.66 R79.1
N$20
  Top 0.61: R78.1 D44.A
N$21
  Top 0.61: D44.C 31.58,77.66 T13.3
N$22
  Top 0.61: T12.3 37.47,85.28 35.56,87.19 R80.2
N$23
  Top 0.61: T13.1 33.97,83.91 R77.2 33.97,84.11 33.97,85.28 33.66,85.6 32.39,85.6 32.17,85.81 R80.1
N$24
  Top 0.406: IC5.1 100.43,39.56 R12.1 97.69,37.55 95.99,36.17 R11.2
N$25  (via drill 0.6)
  Top 0.406: 78.52,68.35 R59.2 | IC9.6 80.64,66.23 80.01,66.87 80.01,67.82 79.48,68.35 78.52,68.35 | v52.71,76.39 45.72,76.39 43.82,74.49 43.82,70.04 41.7,67.92 R83.2 | 78.52,68.35 78.1,68.77 v78.1,69.72
  Bottom 0.406: v52.71,76.39 55.88,73.22 65.72,73.22 67.31,71.63 67.31,70.99 68.26,70.04 77.79,70.04 v78.1,69.72
N$26
  Top 0.406: T14.1 38.91,72.41 40.01,71.31 R83.1
N$27
  Top 0.406: R15.2 63.18,34.48 | 63.18,34.48 C15.1 | IC2.7 64.77,38.29 63.18,36.7 63.18,34.48
N$28
  Top 0.406: D5.C 62.86,50.99 63.5,51.63 69.53,51.63 70.17,50.99 D8.A
N$29
  Top 0.406: D7.C D5.A 62.87,47.18 | 62.87,47.18 63.5,47.82 R18.1 65.1,47.91 C20.1 | 62.87,47.18 63.5,46.55 IC2.3 63.5,43.69 63.82,43.37 66.67,43.37 67.63,44.32 69.53,44.32 70.48,43.37 70.48,38.61 69.85,37.97 66.04,37.97 65.51,37.44 R16.1
N$30
  Top 0.406: D8.C D6.A | D6.A 73.66,45.91 | IC2.1 66.04,45.59 66.99,46.55 66.99,47.71 R18.2 68.58,47.82 69.21,47.18 D8.C | D6.A D52.C | D8.C
N$31
  Top 0.61: D45.A R82.1
N$32
  Top 0.406: T2.1 72.56,37.19 73.66,38.29 | 73.66,38.29 D52.A | R20.2 74.71,37.24 73.66,38.29
N$33  (via drill 0.6)
  Top 0.406: v64.77,20.83 IC1.2
  Bottom 0.406: R27.S 58.42,14.48 v64.77,20.83
N$34  (via drill 0.6)
  Top 0.406: v69.21,100.84 C22.2 | v69.21,96.71 72.39,93.54 74.61,93.54 75.88,92.27 75.88,90.36 76.52,89.73 80.01,89.73 80.64,89.09 R41.1
  Bottom 0.406: v69.21,96.71 v69.21,100.84
N$35
  Top 0.406: C15.2 67.3,36.48 R16.2
N$36
  Top 0.61: D45.C 31.58,73.85 T15.3
N$38
  Top 0.406: D7.A 58.42,52.26 58.74,52.58 73.34,52.58 73.66,52.26 D6.C
N$39
  Top 0.61: R84.2 36.2,64.96 37.47,66.23 T14.3
N$40
  Top 0.406: R25.2 63.18,59.88 | 63.18,59.88 C16.1 | IC3.7 64.77,63.69 63.18,62.1 63.18,59.88
N$41
  Top 0.406: D9.C 62.86,76.39 63.5,77.03 69.53,77.03 70.17,76.39 D12.A
N$42
  Top 0.406: 60.33,72.59 D11.C | 60.33,72.59 D9.A 62.87,72.58 | 60.33,72.59 60.96,71.95 | 62.87,72.58 63.5,73.22 R28.1 65.1,73.31 C21.1 | 62.87,72.58 63.5,71.95 IC3.3 63.5,69.09 63.82,68.77 66.67,68.77 67.63,69.72 69.53,69.72 70.48,68.77 70.48,64.01 69.85,63.37 66.04,63.37 65.51,62.84 R26.1
N$43
  Top 0.406: D12.C D10.A D53.C | IC3.1 66.04,70.99 66.89,71.84 R28.2 68.58,73.22 69.21,72.58 D12.C | D12.C
N$44
  Top 0.61: T15.1 32.07,67.92 R81.2 R84.1
N$45
  Top 0.406: 73.66,63.69 D53.A | T3.1 72.56,62.59 73.66,63.69 | R30.2 74.71,62.64 73.66,63.69
N$47
  Top 0.406: R27.A 59.69,6.22 61.28,4.64 69.85,4.64 70.48,5.27 74.3,5.27 74.61,4.95 74.61,4.42 R5.2 83.82,4 84.45,4.64 D56.A
N$48
  Top 0.406: R26.2 67.21,59.97 C16.2
N$49
  Top 0.406: IC11.9 IC11.10 IC11.11
N$50
  Top 0.406: IC9.11 IC9.10 IC9.9
N$51
  Top 0.406: D11.A 58.42,77.66 58.74,77.98 73.34,77.98 73.66,77.66 D10.C
N$52
  Top 0.305: T16.1 36.52,52.58 37.15,51.94 40.32,51.94 41.27,52.9 41.27,54.8 40.01,56.07 R87.1
N$53
  Top 0.406: R35.2 63.5,85.28 | 63.5,85.28 C17.1 | IC4.7 64.77,89.09 63.5,87.82 63.5,85.28
N$54
  Top 0.406: D13.C 62.86,101.79 63.5,102.43 69.53,102.43 70.17,101.79 D16.A
N$55
  Top 0.406: D15.C D13.A 62.87,97.99 | 62.87,97.99 63.5,98.62 R38.1 65.1,98.71 C22.1 | 62.87,97.99 62.87,97.98 63.5,97.35 IC4.3 63.5,94.49 63.82,94.17 66.67,94.17 67.63,95.12 69.53,95.12 70.48,94.17 70.48,89.41 69.85,88.77 66.04,88.77 65.51,88.24 R36.1
N$56
  Top 0.406: IC4.1 66.04,96.39 66.99,97.35 66.99,98.51 R38.2 68.58,98.62 69.21,97.99 D16.C D14.A D54.C
N$57
  Top 0.61: D46.A 26.04,55.81 R86.1
N$58
  Top 0.406: 73.66,89.09 D54.A | T4.1 72.56,87.99 73.66,89.09 | R40.2 74.71,88.04 73.66,89.09
N$60  (via drill 0.6)
  Top 0.406: R31.1 80.64,63.69 80.01,64.33 76.52,64.33 75.88,64.96 75.88,66.55 74.61,67.82 72.71,67.82 v69.21,71.31 | v69.21,75.44 C21.2
  Bottom 0.406: v69.21,71.31 v69.21,75.44
N$61
  Top 0.406: R36.2 67.21,85.19 C17.2
N$62
  Top 0.406: IC14.5 84.45,16.7 85.72,17.97 85.72,20.19 86.68,21.15 86.68,25.59 88.27,27.18 88.27,34.8 92.71,39.24 92.71,53.85 93.03,54.17 93.03,60.2 96.2,63.37 96.2,73.53 97.16,74.49 97.16,85.6 100.96,89.41 100.96,102.11 100.65,102.43 100.65,104.97 101.28,105.6 IC15.10
N$63  (via drill 0.6)
  Top 0.406: IC11.6 80.64,117.03 80.01,117.67 80.01,118.62 79.48,119.15 R60.2 v78.1,120.52 | v52.71,127.19 45.72,127.19 43.82,125.29 43.82,122.75 42.65,121.58 R66.2
  Bottom 0.406: v52.71,127.19 55.88,124.02 65.72,124.02 67.31,122.43 67.31,121.79 68.26,120.84 77.79,120.84 v78.1,120.52
N$64
  Top 0.406: D15.A 58.42,103.06 58.74,103.38 73.34,103.38 73.66,103.06 D14.C
N$65
  Top 0.61: D46.C 31.58,52.26 T17.3
N$66
  Top 0.406: R45.2 63.5,110.68 | 63.5,110.68 C18.1 | IC6.7 64.77,114.49 63.5,113.22 63.5,110.68
N$67
  Top 0.406: D17.C 62.86,127.19 63.5,127.83 69.53,127.83 70.17,127.19 D20.A
N$68
  Top 0.406: D19.C D17.A 62.87,123.39 | 62.87,123.39 63.5,124.02 R48.1 65.1,124.11 C23.1 | 62.87,123.39 63.5,122.76 IC6.3 63.5,119.89 63.82,119.57 66.67,119.57 67.63,120.52 69.53,120.52 70.48,119.57 70.48,114.81 69.85,114.17 66.04,114.17 65.51,113.64 R46.1
N$69
  Top 0.406: D20.C 69.21,123.38 68.58,124.02 R48.2 66.99,123.91 66.99,122.75 66.04,121.79 IC6.1 | D20.C D18.A D55.C | D20.C 71.75,123.38 | 71.75,123.38 73.02,123.38 | D20.C 71.75,123.39 71.75,123.38
N$70
  Top 0.61: R88.2 36.51,61.79 37.47,60.83 T16.3
N$71
  Top 0.406: T5.1 72.56,113.39 73.66,114.49 | 73.66,114.49 D55.A | R50.2 74.71,113.44 73.66,114.49
N$73
  Top 0.406: D57.C 47,3.37 47.62,4 47.62,7.81 | 47.62,7.81 47.62,8.76 47.94,9.08 R17.1 | R27.E 61.59,6.22 60.01,7.81 47.62,7.81
N$74
  Top 0.406: R46.2 67.21,110.91 C18.2
N$75  (via drill 0.6)
  Top 0.406: IC12.6 80.64,91.63 80.01,92.27 80.01,93.22 79.48,93.75 R62.2 v78.1,95.12 | v52.71,101.79 45.72,101.79 43.82,99.89 43.82,97.03 42.65,95.86 R75.2
  Bottom 0.406: v52.71,101.79 55.88,98.62 65.72,98.62 67.31,97.03 67.31,96.39 68.26,95.44 77.79,95.44 v78.1,95.12
N$76
  Top 0.406: IC13.11 IC13.10 IC13.9
N$77
  Top 0.406: D19.A 58.42,128.46 58.74,128.78 73.34,128.78 73.66,128.46 D18.C
N$78  (via drill 0.6)
  Top 0.406: IC13.6 80.33,40.83 80.01,41.15 80.01,42.42 79.48,42.95 R106.2 v78.1,44.32 | R91.2 40.01,39.56 43.82,42.1 43.82,48.45 45.09,49.72 54.61,49.72 v56.52,47.82
  Bottom 0.406: v78.1,44.32 77.79,44.64 67.94,44.64 67.31,45.28 67.31,46.23 65.72,47.82 v56.52,47.82
N$79
  Top 0.406: IC12.11 IC12.10 IC12.9
N$80  (via drill 0.6)
  Top 0.406: IC13.3 79.38,44.64 v78.1,45.91 78,46.01 R107.2 | R95.2 41.7,43.79 42.55,44.64 42.55,49.09 44.45,50.99 55.25,50.99 v56.52,49.72
  Bottom 0.406: v78.1,45.91 75.56,45.91 70.48,50.99 67.94,50.99 66.67,49.72 v56.52,49.72
N$81  (via drill 0.6)
  Top 0.406: R99.2 43.18,23.69 43.82,24.32 54.93,24.32 v56.52,22.42 | v78.1,18.92 R108.2 79.16,17.55 79.69,17.02 79.69,15.75 80.01,15.43 IC14.6
  Bottom 0.406: v56.52,22.42 65.72,22.42 67.31,20.83 67.31,19.88 67.94,19.24 77.79,19.24 v78.1,18.92
N$83  (via drill 0.6)
  Top 0.406: R109.2 76.3,20.51 v78.1,20.51 79.38,19.24 IC14.3 | R103.2 40.64,23.69 42.55,25.59 55.56,25.59 v56.52,24.32
  Bottom 0.406: v56.52,24.32 66.67,24.32 67.94,25.59 70.48,25.59 75.56,20.51 v78.1,20.51
N$84  (via drill 0.6)
  Top 0.406: v69.21,50.04 C20.2 | v69.21,45.91 72.71,42.42 74.61,42.42 75.88,41.15 75.88,39.56 76.52,38.93 80.01,38.93 80.64,38.29 R21.1
  Bottom 0.406: v69.21,45.91 v69.21,50.04
N$85  (via drill 0.6)
  Top 0.406: v64.77,46.23 IC2.2
  Bottom 0.406: v64.77,46.23 58.42,39.88 R110.S
N$86
  Top 0.406: D58.A 84.45,30.04 83.82,29.4 R37.2 74.61,29.5 74.61,30.35 74.3,30.67 70.48,30.67 69.85,30.04 61.28,30.04 59.69,31.62 R110.A
N$87
  Top 0.406: D59.C 47,28.77 47.62,29.4 47.62,33.21 | R47.1 47.94,34.48 47.62,34.16 47.62,33.21 | R110.E 61.59,31.62 60.01,33.21 47.62,33.21
N$88
  Top 0.406: R113.A 59.69,57.02 61.28,55.44 69.85,55.44 70.48,56.07 74.3,56.07 74.61,55.75 74.61,54.9 R111.2 83.82,54.8 84.45,55.44 D60.A
N$89
  Top 0.406: D61.C 47,54.17 47.62,54.8 47.62,58.61 | 47.62,58.61 47.62,59.56 47.94,59.88 R112.1 | R113.E 61.59,57.02 60.01,58.61 47.62,58.61
N$90
  Top 0.406: R116.A 59.37,82.42 60.96,80.84 70.17,80.84 70.8,81.47 74.3,81.47 74.61,81.15 74.61,80.3 R114.2 83.82,80.2 84.45,80.84 D62.A
N$91
  Top 0.406: R116.E 61.59,82.42 60.01,84.01 47.62,84.01 | D63.C 47,79.57 47.62,80.2 47.62,84.01 | 47.62,84.01 47.62,84.96 47.94,85.28 R115.1
N$92
  Top 0.406: R119.A 59.37,107.82 60.96,106.24 69.85,106.24 70.48,106.87 74.3,106.87 74.61,106.55 74.61,105.7 R117.2 83.82,105.6 84.45,106.24 D64.A
N$93
  Top 0.406: D65.C 47,104.97 47.62,105.6 47.62,109.41 | 47.62,109.41 47.62,110.36 47.94,110.68 R118.1 | R119.E 61.59,107.82 60.01,109.41 47.62,109.41
N$94
  Top 0.61: T6.3 37.47,117.03 36.2,115.76 R65.2
N$95
  Top 0.61: R65.1 R63.2 32.07,118.72 T7.1
N$96
  Top 0.406: R68.1 95.35,47.6 97.05,49.3 R67.2 100.43,50.99 IC7.1
N$97
  Top 0.305: T8.1 36.52,102.74 37.47,101.79 40.01,101.79 41.27,103.06 R71.1
N$98  (via drill 0.6)
  Top 0.406: v64.77,97.03 IC4.2
  Bottom 0.406: v64.77,97.03 58.42,90.68 R116.S
N$99
  Top 0.61: T6.1 38.41,123.28 R66.1
N$100
  Top 0.61: R70.1 D22.A
N$101
  Top 0.61: T17.1 33.97,58.51 R85.2 33.97,58.71 33.97,60.2 32.39,60.2 32.17,60.73 R88.1
N$102
  Top 0.305: 26.04,121.11 R64.1
  Top 0.61: 26.04,121.11 D21.A
N$103
  Top 0.61: D21.C 31.26,124.97 T7.3
N$104
  Top 0.305: T18.1 36.52,28.13 37.15,27.5 40.32,27.5 41.27,28.45 41.27,31.94 40.01,33.21 R91.1
N$105
  Top 0.61: D47.A R90.1
N$106  (via drill 0.6)
  Top 0.406: v64.77,71.63 IC3.2
  Bottom 0.406: v64.77,71.63 58.42,65.28 R113.S
N$107
  Top 0.61: D47.C 31.58,28.13 T19.3
N$108
  Top 0.61: T18.3 37.47,36.39 36.2,37.66 R92.2
N$109
  Top 0.61: T19.1 33.87,31.77 R89.2 33.97,34.58 33.97,36.07 32.39,36.07 32.17,36.6 R92.1
N$110
  Top 0.406: R95.1 40.01,47.18 39.05,48.13 38.56,48.13 T20.1
N$111
  Top 0.61: R94.1 D48.A
N$112
  Top 0.61: T21.3 33.02,49.09 32.39,49.72 D48.C
N$113
  Top 0.61: R96.2 36.2,40.83 37.47,42.1 T20.3
N$114
  Top 0.61: T21.1 32.07,43.47 R93.2 R96.1
N$115  (via drill 0.6)
  Top 0.406: v64.77,122.43 IC6.2
  Bottom 0.406: v64.77,122.43 58.42,116.08 R119.S
N$116
  Top 0.406: IC14.11 IC14.10 IC14.9
N$117  (via drill 0.6)
  Top 0.406: IC12.5 85.41,92.9 86.04,93.54 86.04,101.79 87.63,103.38 91.12,103.38 91.44,103.06 v92.71,103.06 | v104.46,103.06 IC15.8
  Bottom 0.406: v92.71,103.06 v104.46,103.06
N$118  (via drill 0.6)
  Top 0.406: IC9.5 84.77,67.5 86.04,68.77 86.04,75.44 87.95,77.34 87.95,85.28 93.03,90.36 93.03,95.76 v95.57,98.3 | v94.93,109.41 IC15.2
  Bottom 0.406: v95.57,98.3 105.09,98.3 107,100.2 107,107.82 105.41,109.41 v94.93,109.41
N$119  (1 unrouted)
  Top 0.406: R127.1 167.67,48.45 IC16.1
N$125
  Top 0.61: D22.C 31.58,103.06 T9.3
N$126
  Top 0.61: T8.3 37.47,110.68 35.56,112.59 R72.2
N$127
  Top 0.61: T9.1 33.97,109.63 R69.2 33.97,109.83 33.97,111 32.39,111 32.17,111.42 R72.1
N$128
  Top 0.406: D24.C D23.A 52.71,19.24 52.71,17.34 52.07,16.7 R53.1 50.7,15.43 | D25.C | D25.C D26.A 50.7,15.43 | R2.2 50.7,15.43 | D25.C 57.79,14.16 58.74,13.21 60.33,13.21 61.28,14.16 61.28,15.11 61.91,15.75 62.87,15.75 63.5,15.11 IC1.6
N$129
  Top 0.406: 59.48,37.03 D29.A D30.C R13.2 | 59.48,37.03 R15.1 | 59.48,37.03 61.28,37.03 62.23,37.97 IC2.5
N$130
  Top 0.406: D29.C D30.A 50.7,40.83 | D29.C | R14.2 50.7,40.83 | 50.7,40.83 R54.1 52.07,42.1 52.7,42.73 D28.C D27.A | D29.C 57.79,39.56 58.74,38.61 60.33,38.61 61.28,39.56 61.28,40.51 61.91,41.15 62.87,41.15 63.5,40.51 IC2.6
N$131
  Top 0.406: T22.1 36.52,4.32 37.15,3.68 40.32,3.68 41.27,4.64 41.27,14.8 43.18,16.7 R99.1
N$132
  Top 0.61: D49.A 26.04,7.55 R98.1
N$133
  Top 0.406: D33.A D34.C R23.2 | D33.A 61.28,62.43 62.23,63.37 IC3.5 | R25.1 59.48,62.43 D33.A
N$134
  Top 0.406: D33.C D34.A 50.7,66.23 | D33.C | R24.2 50.7,66.23 | 50.7,66.23 R55.1 52.07,67.5 52.7,68.13 D32.C D31.A | D33.C 57.79,64.96 58.74,64.01 60.33,64.01 61.28,64.96 61.28,65.91 61.91,66.55 62.87,66.55 63.5,65.91 IC3.6
N$135
  Top 0.61: D49.C 31.58,4 T23.3
N$136
  Top 0.61: T22.3 37.47,12.26 36.2,13.53 R100.2
N$137
  Top 0.406: R33.2 D38.C D37.A 59.48,87.82 | IC4.5 62.23,88.77 61.28,87.82 59.48,87.82 | R35.1 59.48,87.82
N$138
  Top 0.406: D35.A D36.C 52.71,93.54 52.07,92.9 R56.1 50.7,91.63 | R34.2 50.7,91.63 | 50.7,91.63 D38.A D37.C 57.79,90.36 58.74,89.41 60.33,89.41 61.28,90.36 61.28,91.31 61.91,91.95 62.87,91.95 63.5,91.31 IC4.6
N$139
  Top 0.61: T23.1 33.97,10.25 R97.2 33.66,10.57 33.66,11.62 33.34,11.94 32.39,11.94 32.17,12.47 R100.1
N$140
  Top 0.61: R103.1 39.59,18.39 38.73,19.24 38.73,23.2 T24.1
N$141
  Top 0.305: D42.C
  Top 0.406: R43.2 D42.C | D42.C D41.A 59.48,113.22 | IC6.5 62.23,114.17 61.28,113.22 59.48,113.22 | 59.48,113.22 R45.1
N$142
  Top 0.305: 50.7,117.03
  Top 0.406: D39.A D40.C 52.7,118.93 52.07,118.3 R57.1 50.7,117.03 R44.2 | 50.7,117.03 D42.A D41.C 57.79,115.76 58.74,114.81 60.33,114.81 61.28,115.76 61.28,116.71 61.91,117.35 62.87,117.35 63.5,116.71 IC6.6
N$143
  Top 0.61: R102.1 D50.A
N$144
  Top 0.61: D50.C 32.39,25.59 33.02,24.96 T25.3
N$145
  Top 0.61: T24.3 37.47,17.97 36.2,16.7 R104.2
N$146
  Top 0.61: T25.1 32.07,18.71 R101.2 R104.1
RD0
  Top 0.406: IC11.8 90.8,115.76 92.07,117.03 112.39,117.03 JP2.4
RD1  (via drill 0.6)
  Top 0.406: IC12.8 90.49,90.36 91.12,91 v91.12,94.49
  Bottom 0.406: JP2.10 112.39,106.87 109.85,106.87 108.58,105.6 108.58,97.98 105.09,94.49 94.93,94.49 94.61,94.81 93.34,94.81 93.03,94.49 v91.12,94.49
RD2  (via drill 0.6)
  Top 0.406: IC9.8 90.17,64.96 90.49,65.28 90.49,75.44 91.44,76.39 91.44,87.5 93.98,90.04 v93.98,93.85
  Bottom 0.406: JP2.18 112.39,96.71 110.49,96.71 107.31,93.54 94.3,93.54 v93.98,93.85
RMT  (via drill 0.6)
  Top 0.406: IC13.8 90.49,39.56 90.8,39.88 90.8,54.48 91.12,54.8 91.12,60.83 94.3,64.01 94.3,74.17 95.25,75.12 95.25,86.23 97.79,88.77 v97.79,91.63 | JP2.6 117.47,113.22 v118.74,111.95
  Route15 0.406: v118.74,111.95 118.74,94.17 v116.2,91.63
  Bottom 0.406: v97.79,91.63 v116.2,91.63
RTT  (via drill 0.6)
  Top 0.406: IC14.8 90.17,14.16 90.8,14.8 90.8,24.32 91.44,24.96 91.44,26.23 90.8,26.86 90.8,36.07 93.66,38.93 93.66,53.53 93.98,53.85 93.98,59.88 97.16,63.06 97.16,73.22 98.11,74.17 98.11,85.28 101.92,89.09 101.92,92.58 105.73,96.39 v108.58,96.39
  Route15 0.406: v108.58,96.39 108.9,96.71 115.89,96.71 117.16,97.98 117.16,106.24 115.89,107.51 115.89,109.73 114.93,110.68 JP2.8
S/G(0)_H  (via drill 0.6)
  Top 0.61: v121.28,38.29 120.02,37.02 JP1.6
  Bottom 0.61: JP2.30 114.93,82.74 121.28,76.39 v121.28,38.29
SEL_ECHO  (via drill 0.6)
  Top 0.61: JP1.2 122.55,42.1 v123.82,43.37
  Bottom 0.61: JP2.12 114.93,105.6 123.82,96.71 v123.82,43.37
T/M_ENAB_H  (via drill 0.6)
  Top 0.406: 84.77,20.51 IC14.2 | 84.77,20.51 84.77,18.61 84.14,17.97 IC14.4 | 84.77,20.51 85.72,21.46 85.72,25.91 86.99,27.18 v86.99,30.67 | 84.77,45.91 IC13.2 | 84.77,45.91 v84.77,43.37 IC13.4 | 84.77,45.91 84.77,50.99 89.22,55.44 89.22,61.47 92.39,64.64 92.39,74.8 93.34,75.76 93.34,86.87 95.88,89.41 95.88,95.44 99.38,98.93 99.38,106.87 100.65,108.14 IC15.12
  Bottom 0.406: v86.99,30.67 86.99,41.15 v84.77,43.37
T/M_ENAB_L
  Top 0.406: JP2.34 120.02,77.66 123.82,81.47 123.82,105.6 120.02,109.41 106.05,109.41 | 106.05,109.41 IC15.13 | 106.05,109.41 R121.2
TIMING
  Top 0.406: T1.3 74.51,9.47 R10.2 R7.1 79.69,6.76 79.69,7.81 80.64,8.76 R9.2 82.33,10.14 82.87,10.67 82.87,11.94 83.5,12.57 86.04,12.57 86.68,13.21 86.68,18.61 87.31,19.24 IC14.12 IC14.13
TT(0)  (via drill 0.6)
  Top 0.406: v43.82,11.62 R1.1
  Top 0.61: R98.2 23.75,12.83 v23.18,14.16
  Bottom 0.61: v43.82,11.62 41.27,14.16 v23.18,14.16 21.91,14.16 16.19,19.88 J1.AF2
TT(1)  (via drill 0.6)
  Top 0.406: v43.82,14.16 R2.1
  Top 0.61: R102.2 23.75,16.76 v23.18,15.43
  Bottom 0.61: J1.AH2 15.56,23.05 v23.18,15.43 42.55,15.43 v43.82,14.16
UNIT(1)_H  (via drill 0.6)
  Top 0.61: JP1.8 118.74,34.48 v120.02,35.75
  Bottom 0.61: v120.02,35.75 120.02,75.12 114.93,80.2 JP2.32
V+  (via drill 0.6)
  Top 0.406: R10.1 v71.12,6.54 | R22.1 v71.44,31.94 | R32.1 v71.44,57.34 | IC1.8 67.73,13.95 67.94,14.16 | 67.94,14.16 68.26,14.48 C2.2 | 67.94,14.16 v68.58,13.53 | v78.1,8.76 R8.1 | R108.1 v78.1,14.48 | IC14.14 88.8,21.88 88.9,21.78 C24.2 88.89,23.37 v87.63,23.37 | R109.1 v76.2,23.69 | IC2.8 67.42,39.35 67.63,39.56 | C3.2 68.26,40.2 67.63,39.56 | 67.63,39.56 67.94,39.56 v68.58,38.93 | v78.1,34.16 R20.1 | R37.1 v71.44,29.4 | R107.1 v76.2,49.09 | R106.1 v78.1,39.88 | v87.95,49.09 87.96,49.1 C29.2 89.22,47.6 IC13.14 | IC3.8 67.42,64.75 67.63,64.96 | C4.2 68.26,65.6 67.63,64.96 | 67.63,64.96 67.94,64.96 v68.58,64.33 | v78.1,59.56 R30.1 | R111.1 v71.44,54.8 | IC9.14 89.22,73 C34.2 87.93,74.82 v87.95,74.8 | R59.1 v78.1,65.28 | R58.1 v76.2,74.8 | IC4.8 67.42,90.15 68.26,91 C5.2 68.26,90.68 67.94,90.36 v68.58,89.73 | v78.1,84.96 R40.1 | R42.1 v71.44,82.74 | R114.1 v71.44,80.2 | R62.1 v78.1,90.68 | R105.1 v76.2,100.2 | IC12.14 89.22,98.4 C33.2 87.96,100.22 v87.95,100.2 | R52.1 v71.44,108.14 | IC6.8 67.42,115.55 67.94,116.08 | C6.2 68.26,116.4 67.94,116.08 | 67.94,116.08 v68.58,115.44 | R117.1 v71.44,105.6 | v78.1,110.36 R50.1 | R61.1 v76.2,125.6 | R60.1 v78.1,116.08 | IC11.14 89.22,123.8 C32.2 89.2,125.6 v87.63,125.6 | R5.1 v71.12,4 | C35.2 101.92,113.22 v102.55,112.59 102.77,112.37 IC15.14 | R121.1 v106.05,114.49 | R120.1 R122.1 R124.1 | R123.1 R124.1 | R124.1 103.61,80.3 v103.5,80.52 | R125.1 v93.34,114.49
  Top 0.813: IC8.2 v103.82,73.85 | v103.82,73.85 IC8.4 | C13.+ 103.82,68.77 v103.82,73.85
  Route2 0.406: 71.44,11.62 v78.1,8.76
  Route15 0.406: JP1.16 113.66,24.32 112.39,25.59 109.85,25.59 | 104.77,25.59 104.77,28.13 | 109.85,28.13 112.39,28.13 113.66,26.86
  Route15 1.016: 104.77,28.13 109.85,28.13 | 104.77,25.59 109.85,25.59
  Bottom 0.61: JP1.16 JP1.14
  pour Route15: 67.94,4 68.26,129.73 107.31,129.73 107.31,17.97 89.53,17.97 89.53,4
V-  (via drill 0.6)
  Top 0.406: R68.2 100.01,45.91 100.43,45.91 IC7.3 100.67,44.62 101.92,43.37 C14.- | IC1.4 60.54,19.45 60.33,19.24 | R17.2 v54.93,9.08 | C7.1 60.01,18.92 60.33,19.24 | v60.01,19.56 60.33,19.24 | v54.93,34.48 R47.2 | IC2.4 60.54,44.85 60.33,44.64 | C8.1 60.01,44.32 60.33,44.64 | v60.01,44.96 60.33,44.64 | C9.1 60.01,69.72 60.33,70.04 | IC3.4 60.54,70.25 60.33,70.04 | v60.01,70.36 60.33,70.04 | v54.93,59.88 R112.2 | v54.93,85.28 R115.2 | IC4.4 60.54,95.65 60.33,95.44 | C10.1 60.01,95.12 60.33,95.44 | v60.01,95.76 60.33,95.44 | v54.93,110.68 R118.2 | 60.33,120.84 60.64,121.16 62.12,121.16 IC6.4 | C11.1 60.01,120.52 60.33,120.84 | v60.01,121.16 60.33,120.84
  Top 0.813: v98.74,45.91 100.01,45.91
  Route15 0.406: 54.93,19.56 v60.01,19.56 | 54.93,44.96 v60.01,44.96 | 54.93,70.36 v60.01,70.36 | 54.93,95.76 v60.01,95.76 | 54.93,121.16 v60.01,121.16
  Route15 1.27: v54.93,9.08 54.93,19.56 v54.93,27.18 v54.93,34.48 54.93,44.96 v54.93,59.88 54.93,70.36 v54.93,85.28 54.93,95.76 v54.93,110.68 54.93,121.16
  Bottom 1.27: v54.93,27.18 94.93,27.18 98.74,30.99 v98.74,45.91
W_DATA1_P  (via drill 0.6)
  Top 0.406: R61.2 78,122.53 v78.1,122.43 79.69,120.84 IC11.3 | v56.52,125.92 46.36,125.92 45.09,124.65 45.09,122.11 41.27,118.3 R71.2
  Bottom 0.406: v56.52,125.92 65.41,125.92 66.67,127.19 70.8,127.19 75.56,122.43 v78.1,122.43
W_DATA2_P  (via drill 0.6)
  Top 0.406: R105.2 78,97.13 v78.1,97.03 79.69,95.44 IC12.3 | v56.52,100.52 46.36,100.52 45.09,99.25 45.09,96.39 40.96,92.27 R79.2
  Bottom 0.406: v56.52,100.52 65.41,100.52 66.67,101.79 70.8,101.79 75.56,97.03 v78.1,97.03
W_DATA3_P  (via drill 0.6)
  Top 0.406: R58.2 78,71.73 v78.1,71.63 79.69,70.04 IC9.3 | R87.2 40.01,63.69 45.09,68.77 45.09,73.85 46.36,75.12 v56.52,75.12
  Bottom 0.406: v56.52,75.12 65.41,75.12 66.67,76.39 70.48,76.39 75.25,71.63 v78.1,71.63
WD0(0)  (via drill 0.6)
  Top 0.406: IC11.5 84.45,118.3 v85.72,117.03 | v86.04,111.63 87.31,111.63 88.9,110.05 88.9,106.55 89.85,105.6 93.03,105.6 94.3,104.33 | 94.3,104.33 IC15.6 | IC13.5 85.09,42.1 86.04,43.05 86.04,50.99 90.17,55.12 90.17,61.15 93.34,64.33 93.34,74.49 94.3,75.44 94.3,86.55 96.84,89.09 96.84,95.12 v98.11,96.39 | v90.8,96.71 90.8,97.03 94.3,100.52 94.3,104.33
  Bottom 0.406: v85.72,117.03 85.72,111.95 v86.04,111.63 | v98.11,96.39 91.12,96.39 v90.8,96.71
WD0(1)  (via drill 0.6)
  Top 0.406: IC13.1 82.65,50.14 88.27,55.75 88.27,61.79 91.44,64.96 91.44,75.12 92.39,76.07 v92.39,85.28 92.39,87.19 94.93,89.73 94.93,95.76 v98.42,99.25 | IC11.1 84.45,123.38 85.72,124.65 85.72,127.19 86.99,128.46 90.8,128.46 92.07,127.19 v92.07,118.3 | v92.07,115.76 92.07,108.14 94.61,105.6 v94.93,105.6 IC15.5 | v100.96,85.28 R123.2
  Bottom 0.406: v92.07,115.76 v92.07,118.3 | JP2.28 112.39,84.01 109.85,84.01 108.58,85.28 v100.96,85.28 v92.39,85.28 | v98.42,99.25 104.77,99.25 106.05,100.52 106.05,104.33 104.77,105.6 v94.93,105.6
WD1(1)  (via drill 0.6)
  Top 0.406: IC12.1 82.65,100.94 86.04,104.33 86.04,108.14 86.68,108.78 87.31,108.78 87.95,108.14 87.95,105.6 89.22,104.33 v92.71,104.33 | IC15.9 v104.46,104.33 108.58,104.33 109.85,103.06 109.85,95.44 108.58,94.17 104.77,94.17 103.5,92.9 v103.5,89.09 R124.2
  Bottom 0.406: v92.71,104.33 v104.46,104.33 | v103.5,89.09 104.77,87.82 108.58,87.82 109.85,86.55 112.39,86.55 JP2.26
WD2(1)  (via drill 0.6)
  Top 0.406: IC9.1 82.65,74.59 86.04,77.98 86.04,86.87 88.27,89.09 90.49,89.09 92.07,90.68 v92.07,92.58 92.07,96.71 95.25,99.89 97.47,99.89 98.74,101.16 98.74,110.05 98.11,110.68 IC15.1 93.77,110.68 R125.2
  Bottom 0.406: JP2.20 112.39,94.17 110.49,94.17 108.9,92.58 v92.07,92.58
WD_ENAB  (via drill 0.6)
  Top 0.406: IC9.4 84.45,68.77 84.77,69.09 84.77,71.31 | 84.77,71.31 IC9.2 | 84.77,71.31 84.77,75.44 86.99,77.66 v86.99,86.55 | 84.77,96.71 v84.77,94.17 IC12.4 | 84.77,96.71 IC12.2 | 84.77,96.71 84.77,101.79 86.99,104.01 v86.99,107.82 | IC11.2 84.45,122.11 84.77,121.79 v84.77,119.57 IC11.4 | v94.93,106.87 IC15.4
  Bottom 0.406: v86.99,86.55 86.99,87.82 85.72,89.09 85.72,93.22 v84.77,94.17 | v84.77,119.57 86.99,117.35 v86.99,107.82 87.95,106.87 v94.93,106.87
WD_ENAB_TD8E  (via drill 0.6)
  Top 0.406: R120.2 108.58,90.36 109.85,91.63 112.39,91.63 JP2.22 115.57,92.9 117.16,94.49 v117.16,108.14 | v94.93,108.14 IC15.3
  Bottom 0.406: v117.16,108.14 115.89,109.41 109.85,109.41 108.58,110.68 108.58,112.27 107.31,113.54 94.3,113.54 93.03,112.27 93.03,109.09 93.98,108.14 v94.93,108.14
WRT_ECHO  (via drill 0.6)
  Top 0.61: v122.55,40.83 121.28,39.56 JP1.4
  Bottom 0.61: JP2.16 114.93,100.52 122.55,92.9 v122.55,40.83
WTT(1)  (via drill 0.6)
  Top 0.406: IC14.1 84.45,21.78 84.77,22.1 84.77,26.23 85.72,27.18 85.72,30.99 86.68,31.94 86.68,34.48 91.76,39.56 91.76,54.17 92.07,54.48 92.07,60.52 95.25,63.69 95.25,73.85 96.2,74.8 96.2,85.92 100.01,89.73 v100.01,90.36 100.01,105.92 100.96,106.87 IC15.11 | v106.05,89.09 R122.2
  Bottom 0.406: JP2.24 112.39,89.09 v106.05,89.09 104.77,90.36 v100.01,90.36

## Text on the board
tNames: TD8E interface v1.0 Anders Sandahl 2019 | 1